# EAGLE board expansion_board_V0 (EAGLE 7.2.0), part 1 of 3
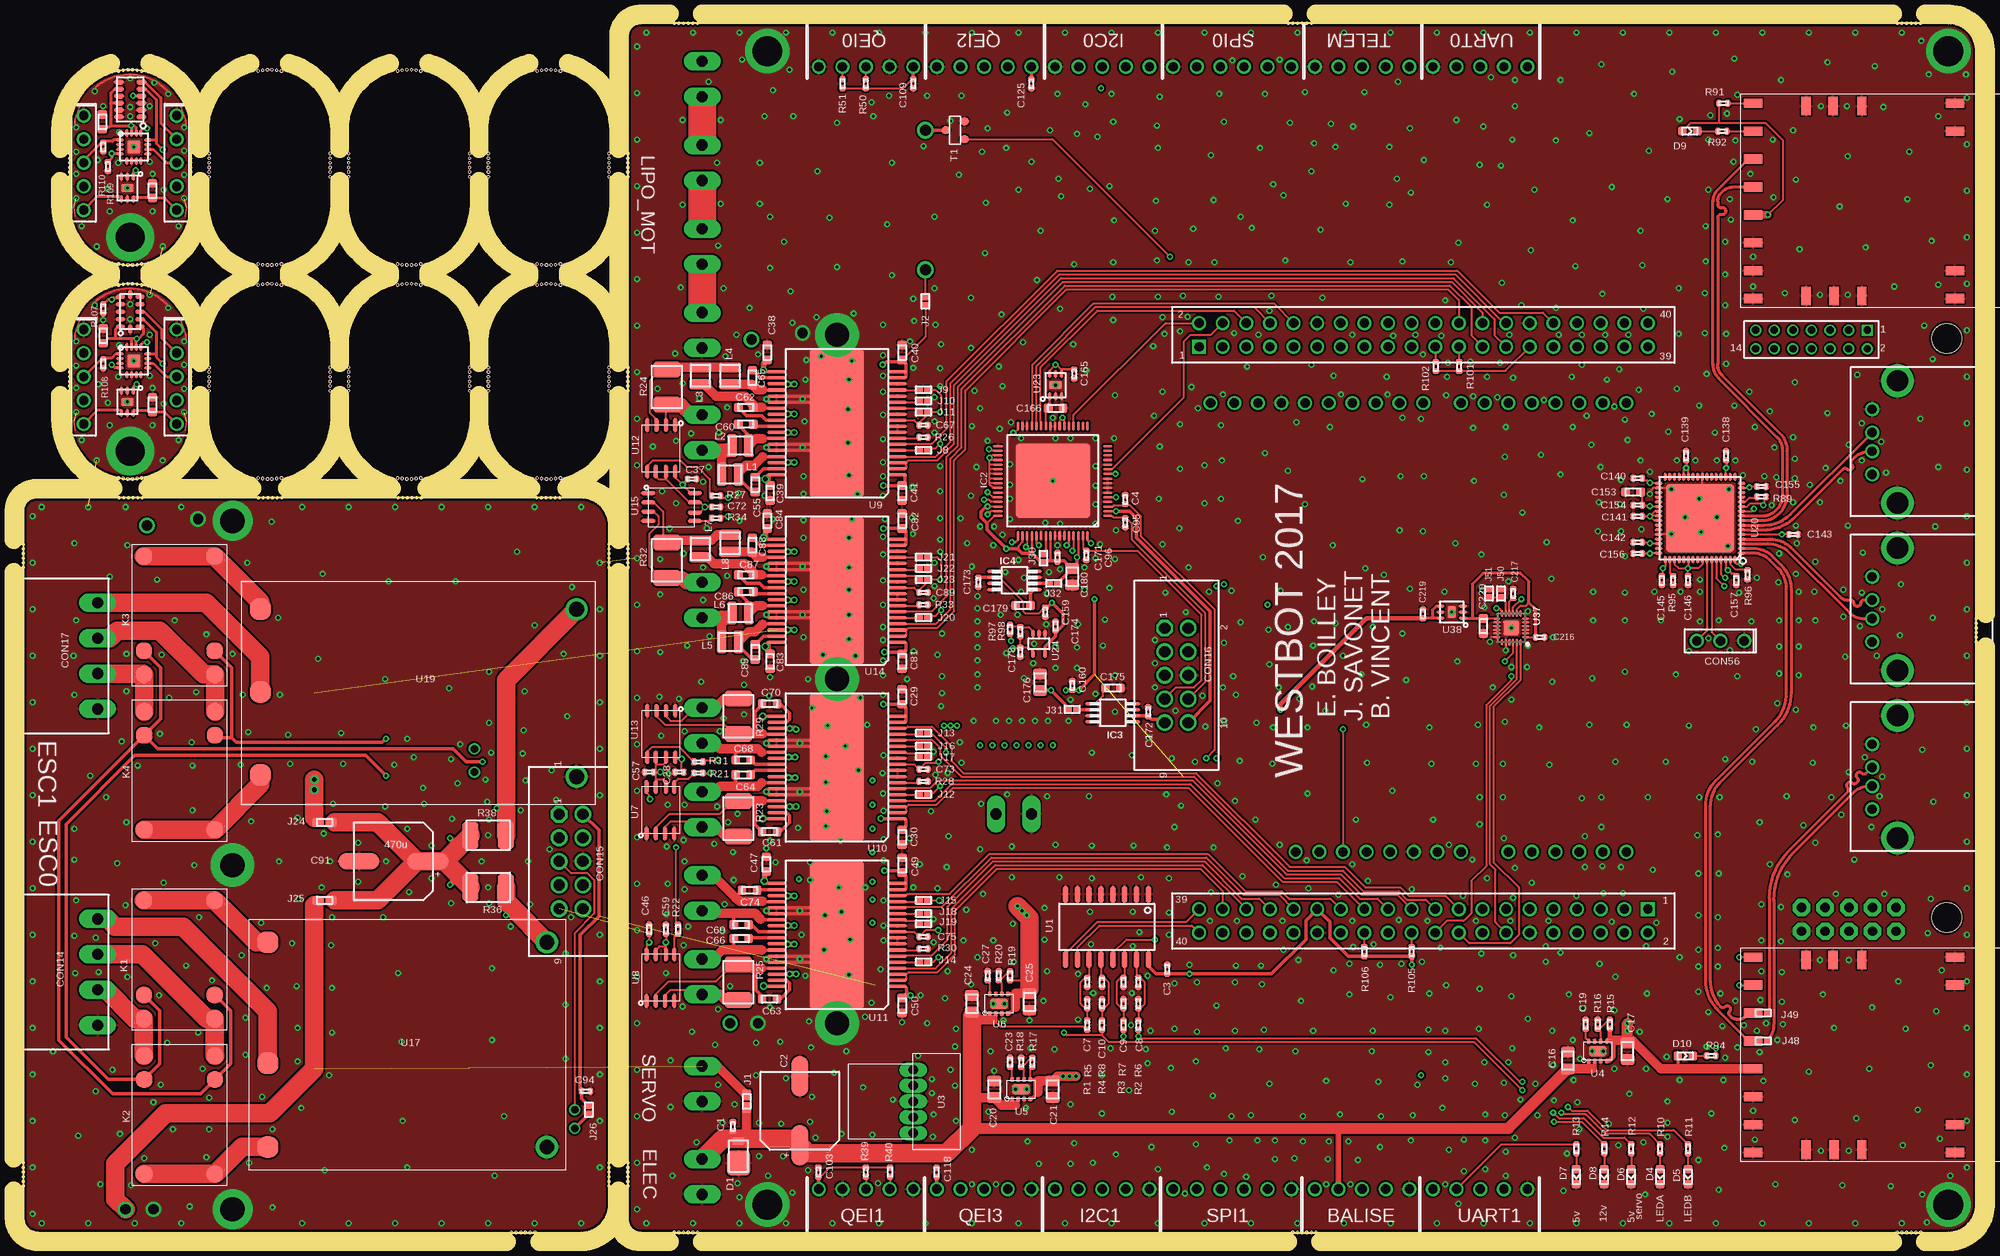
[diagram p8: board, top side]
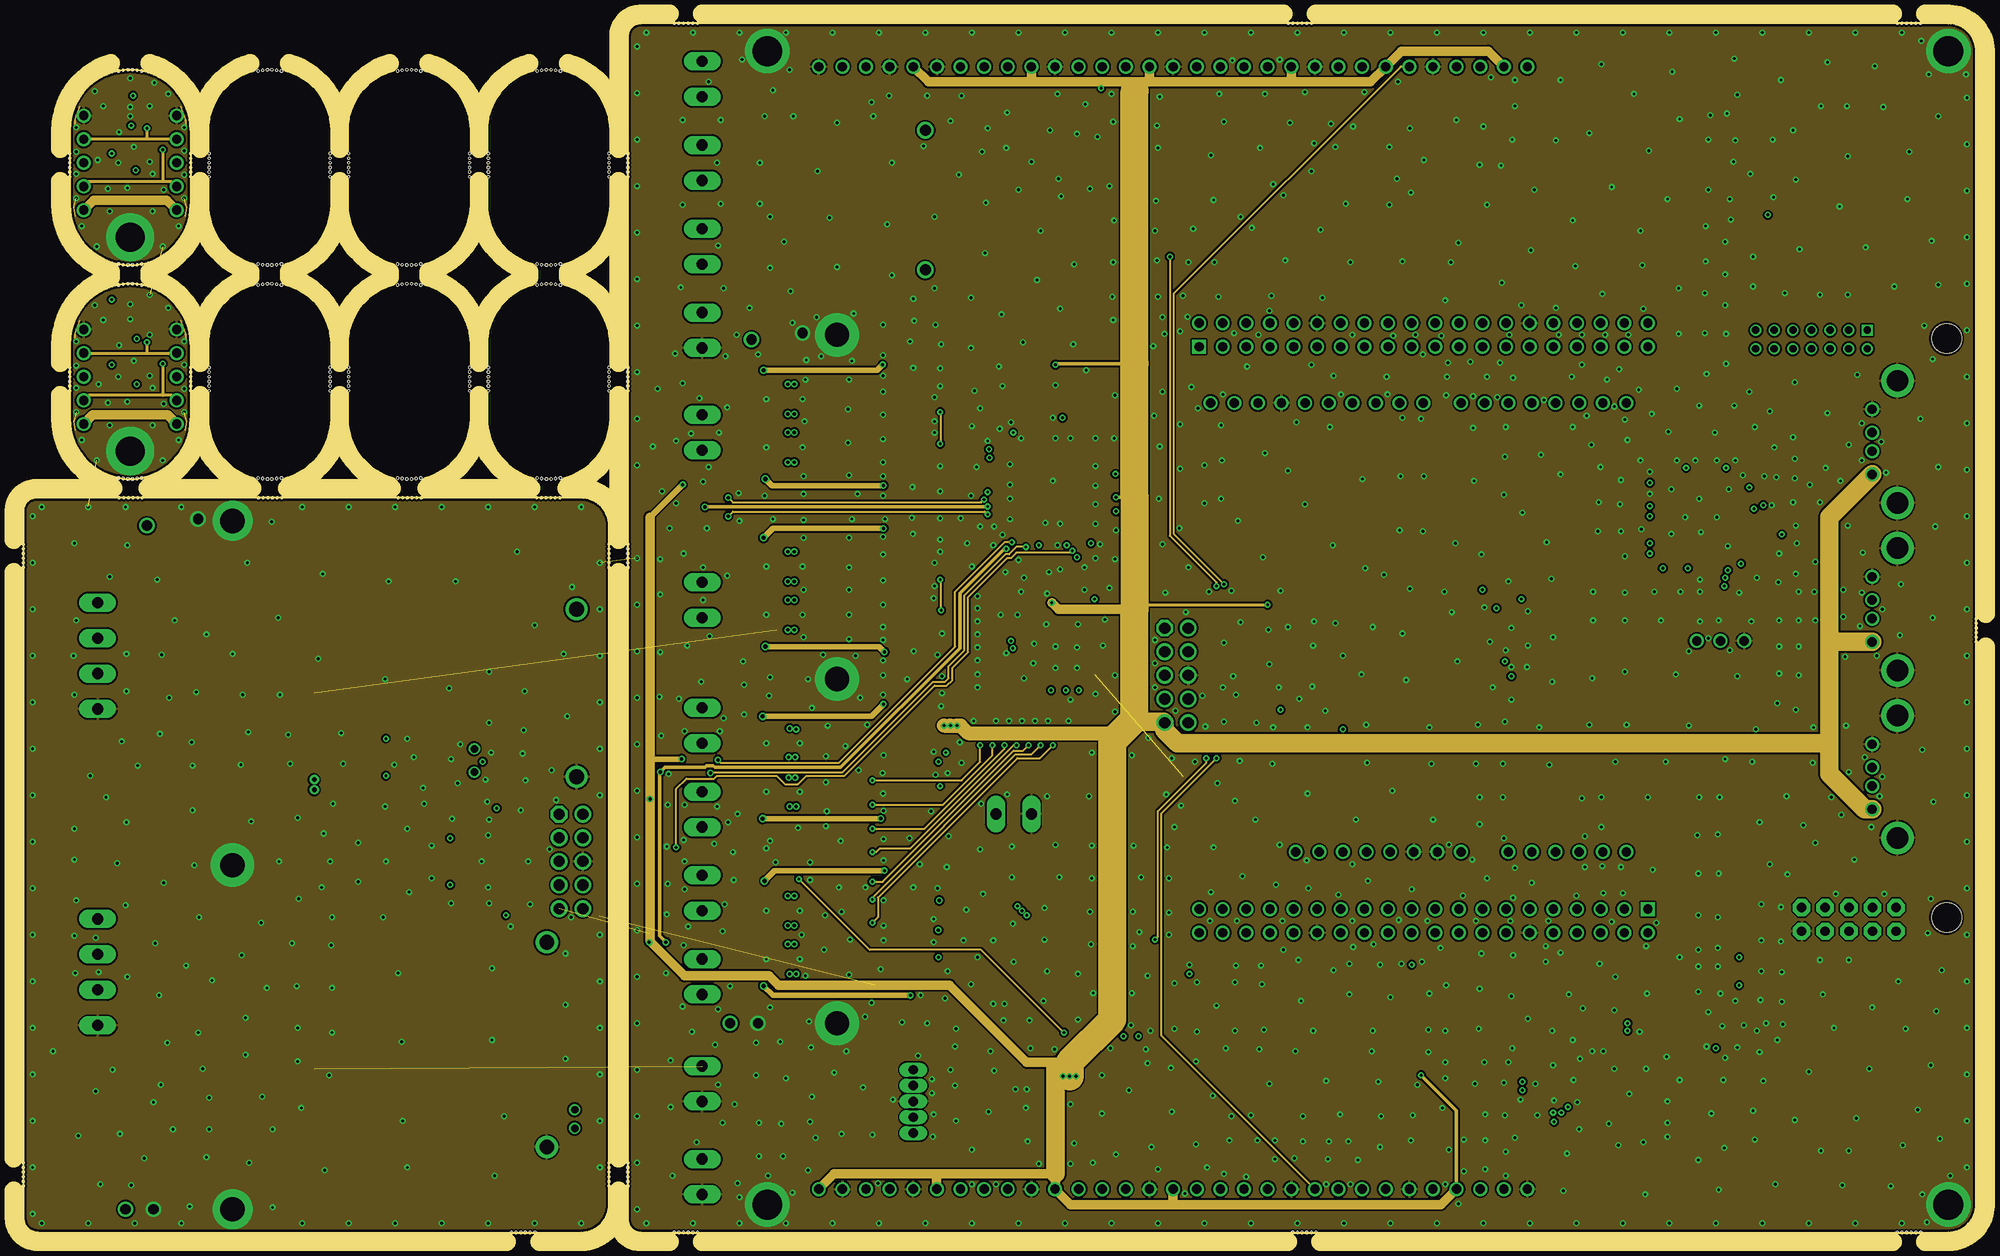
[diagram p9: board, inner layer Route2]
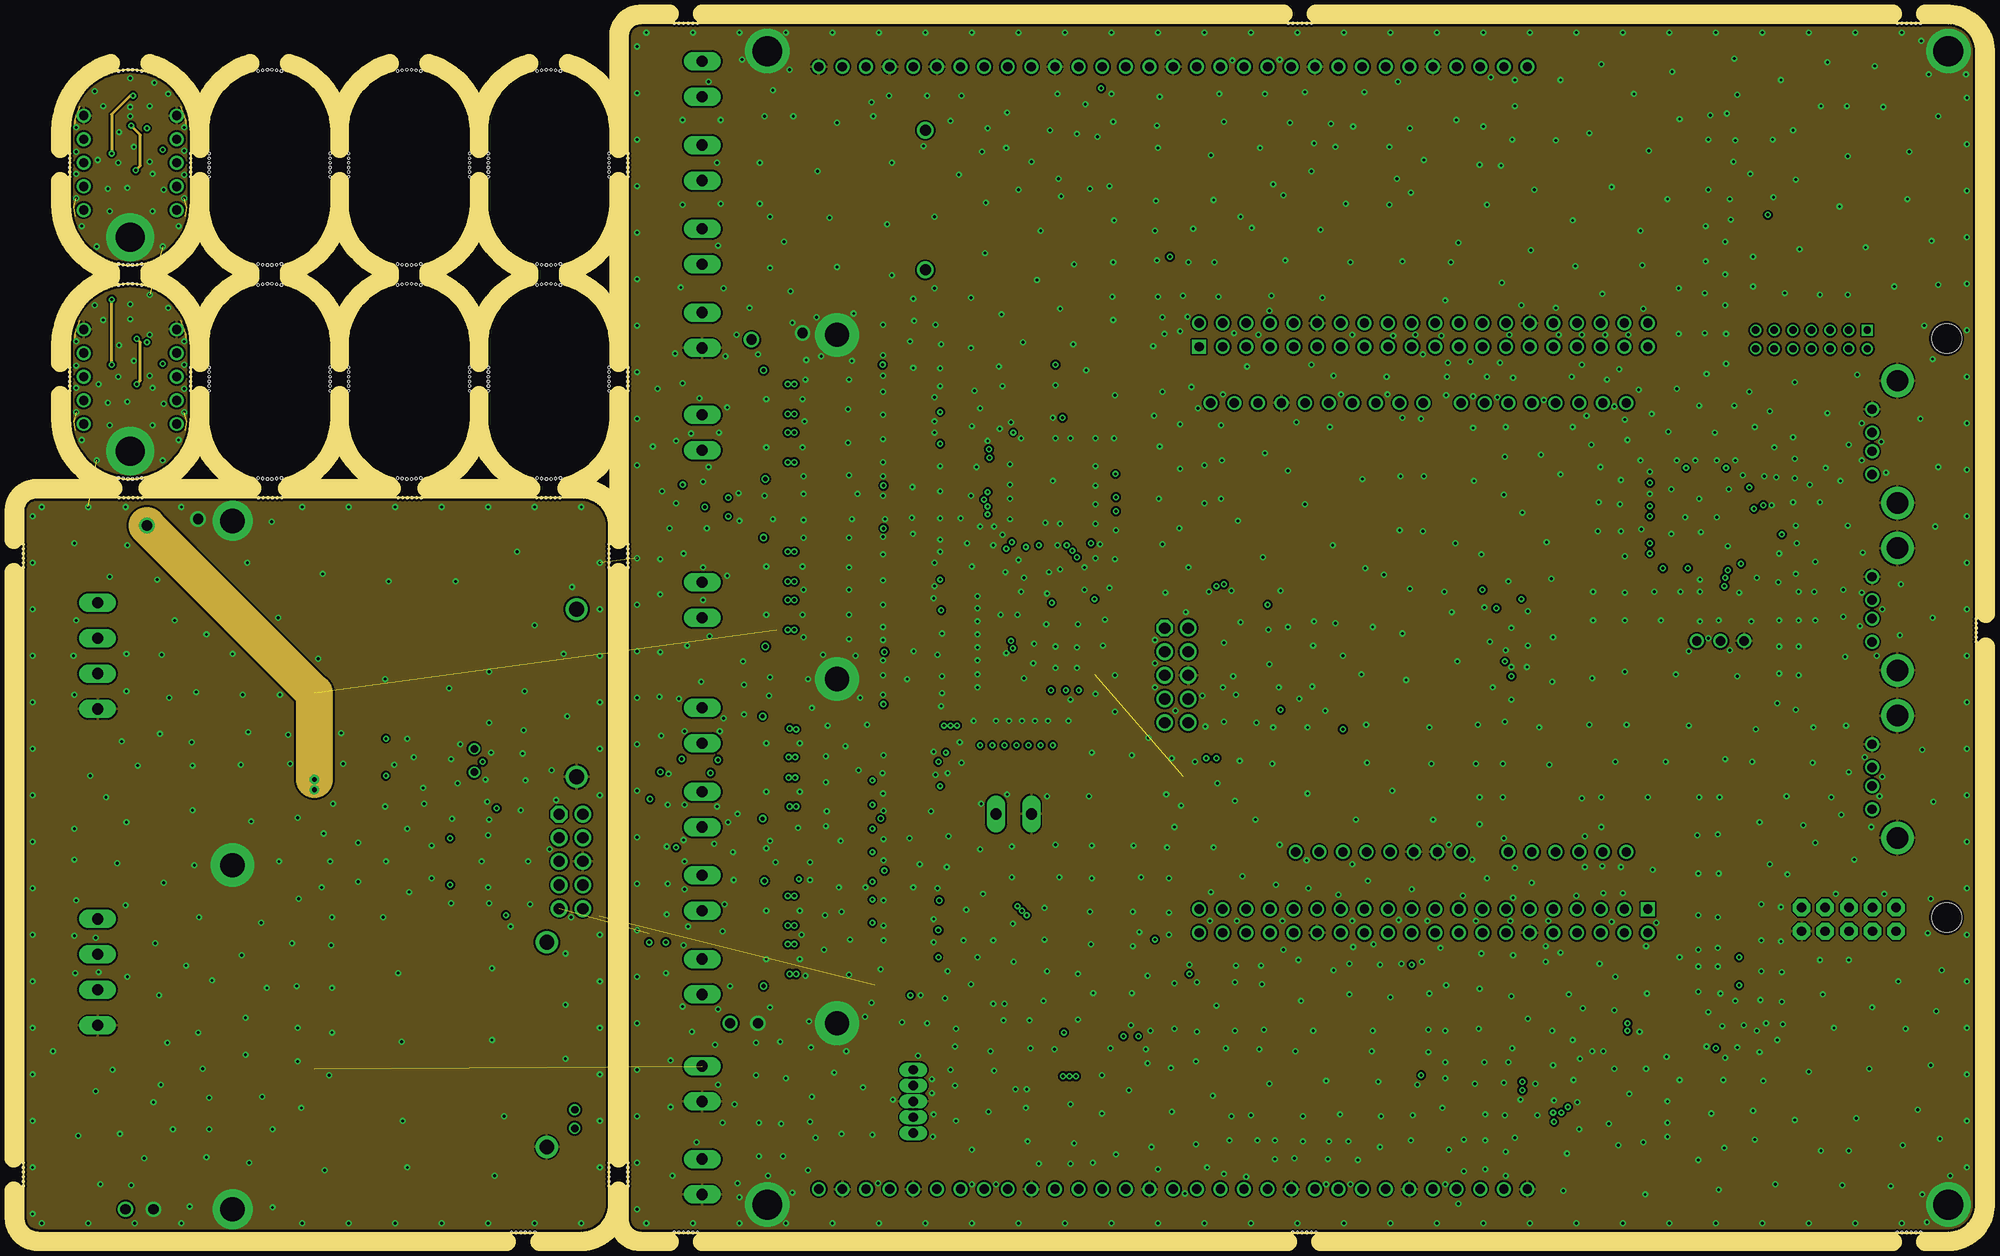
[diagram p10: board, inner layer Route15]
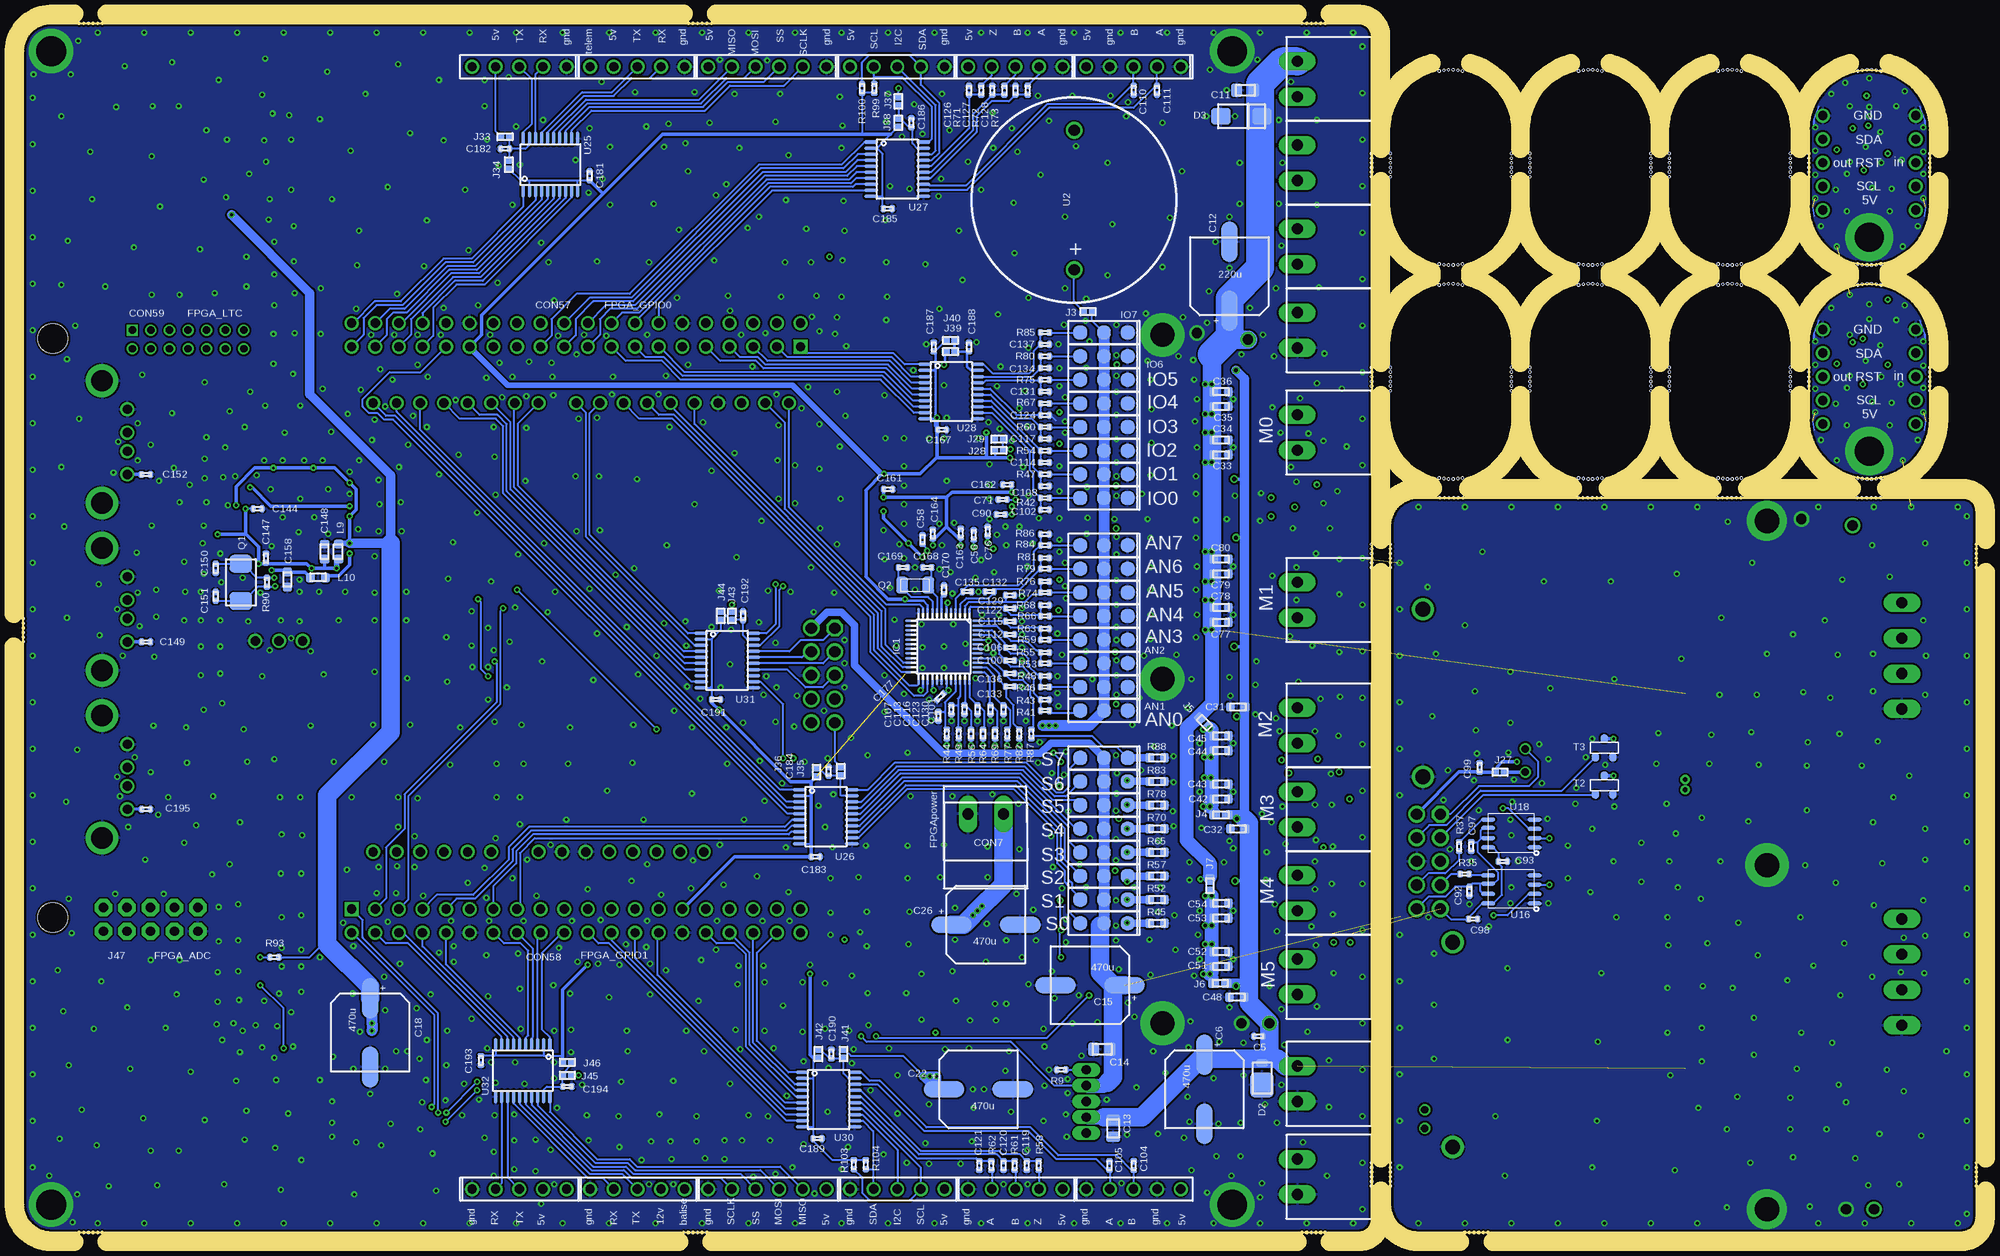
[diagram p11: board, bottom side, seen from below]

Size 210 x 130 mm. Coordinates in mm from the lower left corner, seen from the top.
Outline: 207,130 66.4,130 arc90 65,128.6 65,1.4 arc90 66.4,0 207,0 arc90 210,3 210,127 arc90 207,130
Outline: 60,79 1.4,79 arc90 0,77.6 0,1.6 arc90 1.6,0 60,0 arc90 63,3 63,76 arc90 60,79
Outline: 5,87.5 arc180 18,87.5 18,95.5 arc180 5,95.5 5,87.5
Outline: 5,110.5 arc180 18,110.5 18,118.5 arc180 5,118.5 5,110.5
Copper layers (1*2*15*16): Top 0.035mm / dielectric 10mil / Route2 0.018mm / dielectric 0.46mm / Route15 0.018mm / dielectric 10mil / Bottom 0.035mm
Design rules "Layers4 Classe6 *": minimum track width 0.15mm, minimum drill 0.25mm, track to track 0.15mm, track to pad 0.15mm, pad to pad 0.15mm, via to via 0.15mm, smd to smd 0.15mm, copper to edge 0.25mm, drill to drill 0.35mm, minimum pad ring 0.175mm, minimum via ring 0.175mm, stop-mask expansion 0mil, vias tented up to drill 0.45mm, thermal gap 0.18mm
Holes 0.25 mm at 5,114 5,114.5 5,115 5,115.5 5,116 5,113.5 18,114 18,114.5 18,115 18,115.5 18,116 18,113.5 12.25,124.95 11.75,125 11.25,125 10.75,124.95 10.25,124.88 12.75,124.88 12.25,104.05 11.75,104 11.25,104 10.75,104.05 10.25,104.12 12.75,104.12 20,114 20,114.5 20,115 20,115.5 20,116 20,113.5 33,114 33,114.5 33,115 33,115.5 33,116 33,113.5 27.25,124.95 26.75,125 26.25,125 25.75,124.95 25.25,124.88 27.75,124.88 27.25,104.05 26.75,104 26.25,104 25.75,104.05 25.25,104.12 27.75,104.12 5,91 5,91.5 5,92 5,92.5 5,93 5,90.5 18,91 18,91.5 18,92 18,92.5 18,93 18,90.5 12.25,101.95 11.75,102 11.25,102 10.75,101.95 10.25,101.88 12.75,101.88 12.25,81.05 11.75,81 11.25,81 10.75,81.05 10.25,81.12 12.75,81.12 35,114 35,114.5 35,115 35,115.5 35,116 35,113.5 48,114 48,114.5 48,115 48,115.5 48,116 48,113.5 42.25,124.95 41.75,125 41.25,125 40.75,124.95 40.25,124.88 42.75,124.88 42.25,104.05 41.75,104 41.25,104 40.75,104.05 40.25,104.12 42.75,104.12 50,114 50,114.5 50,115 50,115.5 50,116 50,113.5 63,114 63,114.5 63,115 63,115.5 63,116 63,113.5 57.25,124.95 56.75,125 56.25,125 55.75,124.95 55.25,124.88 57.75,124.88 57.25,104.05 56.75,104 56.25,104 55.75,104.05 55.25,104.12 57.75,104.12 20,91 20,91.5 20,92 20,92.5 20,93 20,90.5 33,91 33,91.5 33,92 33,92.5 33,93 33,90.5 27.25,101.95 26.75,102 26.25,102 25.75,101.95 25.25,101.88 27.75,101.88 27.25,81.05 26.75,81 26.25,81 25.75,81.05 25.25,81.12 27.75,81.12 35,91 35,91.5 35,92 35,92.5 35,93 35,90.5 48,91 48,91.5 48,92 48,92.5 48,93 48,90.5 42.25,101.95 41.75,102 41.25,102 40.75,101.95 40.25,101.88 42.75,101.88 42.25,81.05 41.75,81 41.25,81 40.75,81.05 40.25,81.12 42.75,81.12 50,91 50,91.5 50,92 50,92.5 50,93 50,90.5 63,91 63,91.5 63,92 63,92.5 63,93 63,90.5 57.25,101.95 56.75,102 56.25,102 55.75,101.95 55.25,101.88 57.75,101.88 57.25,81.05 56.75,81 56.25,81 55.75,81.05 55.25,81.12 57.75,81.12 12.3,79 11.8,79 11.3,79 10.8,79 10.3,79 12.8,79 27.3,79 26.8,79 26.3,79 25.8,79 25.3,79 27.8,79 42.3,79 41.8,79 41.3,79 40.8,79 40.3,79 42.8,79 57.2,79 56.7,79 56.2,79 55.7,79 55.2,79 57.7,79 65,91 65,91.5 65,92 65,92.5 65,93 65,90.5 65,114 65,114.5 65,115 65,115.5 65,116 65,113.5 0,72 0,72.5 0,73 0,73.5 0,74 0,71.5 0,5.5 0,6 0,6.5 0,7 0,7.5 0,5 54.5,0 54,0 53.5,0 53,0 52.5,0 55,0 63,5.5 63,6 63,6.5 63,7 63,7.5 63,5 65,5.5 65,6 65,6.5 65,7 65,7.5 65,5 63,72 63,72.5 63,73 63,73.5 63,74 63,71.5 65,72 65,72.5 65,73 65,73.5 65,74 65,71.5 72,0 71.5,0 71,0 70.5,0 70,0 72.5,0 138.5,0 138,0 137.5,0 137,0 136.5,0 139,0 203.5,0 203,0 202.5,0 202,0 201.5,0 204,0 210,64 210,64.5 210,65 210,65.5 210,66 210,63.5 203.5,130 203,130 202.5,130 202,130 201.5,130 204,130 72,130 71.5,130 71,130 70.5,130 70,130 72.5,130 138,130 137.5,130 137,130 136.5,130 136,130 138.5,130
Holes 3.2 mm at 206.82,96.12 206.82,33.88
Milling: area 15,99 to 23,107; area 30,99 to 38,107; area 45,99 to 53,107; area 60,99 to 64,107; area 60,77 to 64,85; area 45,80 to 53,84; area 30,80 to 38,84; area 15,80 to 23,84; 111 lines

## Footprints (pad centres in the part's own frame; a part is rotated, then mirrored left to right if it is on the bottom)
CAPC1005X55N = smd 0.62 x 0.72: 1 -0.48,0; 2 0.48,0
CAPAE835X1020N = smd 4.4 x 1.8: + -3.7,0; - 3.7,0
CAPC2013X100N = smd 1.15 x 1.45: P$1 -0.9,0; P$2 0.9,0
CAPC1608X95N = smd 0.95 x 1: P$1 -0.8,0; P$2 0.8,0
PHOENIX381P900X920-2N = drill 1.2 pad 2 long: P$1 -1.905,0; P$2 1.905,0
PHOENIX381P1662X920-4N = drill 1.2 pad 2 long: P$1 -5.715,0; P$2 -1.905,0; P$3 1.905,0; P$4 5.715,0
CON245P2030X890-2X5N = drill 1.2 pad 1.8 octagon: P$1 -5.08,-1.27 | drill 1.2 pad 1.8: P$2 -5.08,1.27; P$3 -2.54,-1.27; P$4 -2.54,1.27; P$5 0,-1.27; P$6 0,1.27; P$7 2.54,-1.27; P$8 2.54,1.27; P$9 5.08,-1.27; P$10 5.08,1.27
CON254P1270X400-5S = drill 1 pad 1.4: 1 -5.08,0; 2 -2.54,0; 3 0,0; 4 2.54,0; 5 5.08,0
CON254P762X400-3SMT = smd 1.5 x 1.5: 1 -2.54,0; 2 0,0; 3 2.54,0
CON254P1524X400-6N-S = drill 1 pad 1.4: 1 -6.35,0; 2 -3.81,0; 3 -1.27,0; 4 1.27,0; 5 3.81,0; 6 6.35,0
USB_A = drill 1 pad 1.4: 1 0,-3.5; 2 0,-1; 3 0,1; 4 0,3.5 | drill 2.3 pad 3.5: GND1 2.72,-6.57; GND2 2.72,6.57
CON254P762X400-3N-S = drill 1 pad 1.4: 1 -2.54,0; 2 0,0; 3 2.54,0
CON254P5080X600-40N = drill 1 pad 1.45 square: 1 -24.13,-1.27 | drill 1 pad 1.45: 2 -24.13,1.27; 3 -21.59,-1.27; 4 -21.59,1.27; 5 -19.05,-1.27; 6 -19.05,1.27; 7 -16.51,-1.27; 8 -16.51,1.27; 9 -13.97,-1.27; 10 -13.97,1.27; 11 -11.43,-1.27; 12 -11.43,1.27; 13 -8.89,-1.27; 14 -8.89,1.27; 15 -6.35,-1.27; 16 -6.35,1.27; 17 -3.81,-1.27; 18 -3.81,1.27; 19 -1.27,-1.27; 20 -1.27,1.27; 21 1.27,-1.27; 22 1.27,1.27; 23 3.81,-1.27; 24 3.81,1.27; 25 6.35,-1.27; 26 6.35,1.27; 27 8.89,-1.27; 28 8.89,1.27; 29 11.43,-1.27; 30 11.43,1.27; 31 13.97,-1.27; 32 13.97,1.27; 33 16.51,-1.27; 34 16.51,1.27; 35 19.05,-1.27; 36 19.05,1.27; 37 21.59,-1.27; 38 21.59,1.27; 39 24.13,-1.27; 40 24.13,1.27
CON200P1700X400-2X7N = drill 0.8 pad 1.2 square: P$1 -6,-1 | drill 0.8 pad 1.2: P$2 -6,1; P$3 -4,-1; P$4 -4,1; P$5 -2,-1; P$6 -2,1; P$7 0,-1; P$8 0,1; P$9 2,-1; P$10 2,1; P$11 4,-1; P$12 4,1; P$13 6,-1; P$14 6,1
DO220AA = smd 2.667 x 2.54: A -1.333,0 | smd 0.762 x 1.27: C 1.016,0
D0214AC = smd 2.1 x 1.8: A -2.2,0; C 2.2,0
LEDC1608X60N = smd 0.9 x 0.95: A -0.8,0; C 0.8,0
QFN48 = smd 1.1 x 0.25: 1 -3.6,2.75; 2 -3.6,2.25; 3 -3.6,1.75; 4 -3.6,1.25; 5 -3.6,0.75; 6 -3.6,0.25; 7 -3.6,-0.25; 8 -3.6,-0.75; 9 -3.6,-1.25; 10 -3.6,-1.75; 11 -3.6,-2.25; 12 -3.6,-2.75; 25 3.6,-2.75; 26 3.6,-2.25; 27 3.6,-1.75; 28 3.6,-1.25; 29 3.6,-0.75; 30 3.6,-0.25; 31 3.6,0.25; 32 3.6,0.75; 33 3.6,1.25; 34 3.6,1.75; 35 3.6,2.25; 36 3.6,2.75 | smd 0.25 x 1.1: 13 -2.75,-3.6; 14 -2.25,-3.6; 15 -1.75,-3.6; 16 -1.25,-3.6; 17 -0.75,-3.6; 18 -0.25,-3.6; 19 0.25,-3.6; 20 0.75,-3.6; 21 1.25,-3.6; 22 1.75,-3.6; 23 2.25,-3.6; 24 2.75,-3.6; 37 2.75,3.6; 38 2.25,3.6; 39 1.75,3.6; 40 1.25,3.6; 41 0.75,3.6; 42 0.25,3.6; 43 -0.25,3.6; 44 -0.75,3.6; 45 -1.25,3.6; 46 -1.75,3.6; 47 -2.25,3.6; 48 -2.75,3.6
TQFP64_POWERPAD = smd 1 x 0.27: 1 -5.9,3.75; 2 -5.9,3.25; 3 -5.9,2.75; 4 -5.9,2.25; 5 -5.9,1.75; 6 -5.9,1.25; 7 -5.9,0.75; 8 -5.9,0.25; 9 -5.9,-0.25; 10 -5.9,-0.75; 11 -5.9,-1.25; 12 -5.9,-1.75; 13 -5.9,-2.25; 14 -5.9,-2.75; 15 -5.9,-3.25; 16 -5.9,-3.75; 33 5.9,-3.75; 34 5.9,-3.25; 35 5.9,-2.75; 36 5.9,-2.25; 37 5.9,-1.75; 38 5.9,-1.25; 39 5.9,-0.75; 40 5.9,-0.25; 41 5.9,0.25; 42 5.9,0.75; 43 5.9,1.25; 44 5.9,1.75; 45 5.9,2.25; 46 5.9,2.75; 47 5.9,3.25; 48 5.9,3.75 | smd 0.27 x 1: 17 -3.75,-5.9; 18 -3.25,-5.9; 19 -2.75,-5.9; 20 -2.25,-5.9; 21 -1.75,-5.9; 22 -1.25,-5.9; 23 -0.75,-5.9; 24 -0.25,-5.9; 25 0.25,-5.9; 26 0.75,-5.9; 27 1.25,-5.9; 28 1.75,-5.9; 29 2.25,-5.9; 30 2.75,-5.9; 31 3.25,-5.9; 32 3.75,-5.9; 49 3.75,5.9; 50 3.25,5.9; 51 2.75,5.9; 52 2.25,5.9; 53 1.75,5.9; 54 1.25,5.9; 55 0.75,5.9; 56 0.25,5.9; 57 -0.25,5.9; 58 -0.75,5.9; 59 -1.25,5.9; 60 -1.75,5.9; 61 -2.25,5.9; 62 -2.75,5.9; 63 -3.25,5.9; 64 -3.75,5.9 | smd 8 x 8: POWERPAD 0,0
MSOP8_0.65 = smd 1.2 x 0.4: 1 -2.35,0.975; 2 -2.35,0.325; 3 -2.35,-0.325; 4 -2.35,-0.975; 5 2.35,-0.975; 6 2.35,-0.325; 7 2.35,0.325; 8 2.35,0.975
JUMC1608X50AN = smd 1.2 x 1: P$1 -0.675,0; P$2 0.675,0
JUMC1005X50N = smd 0.68 x 0.72: P$1 -0.42,0; P$2 0.42,0
2X5_NOSILK = drill 1.016 pad 1.88 octagon: 1 -1.27,5.08; 2 1.27,5.08; 3 -1.27,2.54; 4 1.27,2.54; 5 -1.27,0; 6 1.27,0; 7 -1.27,-2.54; 8 1.27,-2.54; 9 -1.27,-5.08; 10 1.27,-5.08
V23101-D0103-A201-SMT = smd 1.778 x 1.778: 1 0,0; 2 2.54,0; 6 12.7,0; 7 12.7,7.62; 11 2.54,7.62; 12 0,7.62
INDC2520X120N = smd 1.05 x 2.4: P$1 -0.9,0; P$2 0.9,0
INDC1608X95N = smd 0.95 x 1: 1 -0.8,0; 2 0.8,0
XTAL500X320X130N = smd 1.9 x 2.4: 1 -2,0; 2 2,0
1206 = smd 1.3 x 1.8: P$1 -1.4,0; P$2 1.4,0
RESC1005X40N = smd 0.62 x 0.72: 1 -0.48,0; 2 0.48,0
RESC_ULR15S-R0055FT2 = smd 1.7 x 2.9: P$1 -1.9,0; P$2 1.9,0
RESC1608X50AN = smd 0.95 x 1: P$1 -0.8,0; P$2 0.8,0
SOT95P290X130-3N = smd 0.8 x 0.9: P$1 -0.95,-1; P$2 0.95,-1; P$3 0,1
SOIC127P780X200-16N = smd 1.85 x 0.6: 1 -3.5,4.445; 2 -3.5,3.175; 3 -3.5,1.905; 4 -3.5,0.635; 5 -3.5,-0.635; 6 -3.5,-1.905; 7 -3.5,-3.175; 8 -3.5,-4.445; 9 3.5,-4.445; 10 3.5,-3.175; 11 3.5,-1.905; 12 3.5,-0.635; 13 3.5,0.635; 14 3.5,1.905; 15 3.5,3.175; 16 3.5,4.445
BUZZER_CIRCLE = drill 1.2 pad 1.6: + -7.5,0; - 7.5,0
PTR08100W = drill 1 pad 1.27 long: P$1 3.4,0; P$2 1.7,0; P$3 0,0; P$4 -1.7,0; P$5 -3.4,0
SON65P310X290X153-9N = smd 0.5 x 0.4: P$1 -1.05,0.975; P$2 -1.05,0.325; P$3 -1.05,-0.325; P$4 -1.05,-0.975; P$5 1.05,-0.975; P$6 1.05,-0.325; P$7 1.05,0.325; P$8 1.05,0.975 | smd 1.1 x 1.9: P$9 0,0
TSSOP = smd 1.5 x 0.45: P$1 -2.5,1.6; P$2 -2.5,0.6; P$3 -2.5,-0.4; P$4 -2.5,-1.4; P$5 2.5,1.6; P$6 2.5,0.6; P$7 2.5,-0.5; P$8 2.5,-1.4
R-PDSO-G36 = smd 0.4 x 2: P$1 -5.525,-6.5; P$2 -4.875,-6.5; P$3 -4.225,-6.5; P$4 -3.575,-6.5; P$5 -2.925,-6.5; P$6 -2.275,-6.5; P$7 -1.625,-6.5; P$8 -0.975,-6.5; P$9 -0.325,-6.5; P$10 0.325,-6.5; P$11 0.975,-6.5; P$12 1.625,-6.5; P$13 2.275,-6.5; P$14 2.925,-6.5; P$15 3.575,-6.5; P$16 4.225,-6.5; P$17 4.875,-6.5; P$18 5.525,-6.5; P$19 5.525,6.5; P$20 4.875,6.5; P$21 4.225,6.5; P$22 3.575,6.5; P$23 2.925,6.5; P$24 2.275,6.5; P$25 1.625,6.5; P$26 0.975,6.5; P$27 0.325,6.5; P$28 -0.325,6.5; P$29 -0.975,6.5; P$30 -1.625,6.5; P$31 -2.275,6.5; P$32 -2.925,6.5; P$33 -3.575,6.5; P$34 -4.225,6.5; P$35 -4.875,6.5; P$36 -5.525,6.5 | smd 15.8 x 5.8: P$37 0,0
ESC_TURNIGY40A = drill 1.6 pad 2.2: GND -30,22; PWR -30,0 | drill 0.8 pad 1.2: PWM -33,18; VCC -33,20 | smd 2.286 x 2.286: U 0,0; V 0,13; W 0,22
ESC_CHINOI15A = drill 1.6 pad 2.2: GND -34,18; PWR -34,0 | drill 0.8 pad 1.2: PWM -23,15; VCC -23,17.5 | smd 2.286 x 2.286: U 0,0; V 0,8.89; W 0,17.78
QFN50P900X900X100-65N = smd 0.85 x 0.3: 1 -4.45,3.75; 2 -4.45,3.25; 3 -4.45,2.75; 4 -4.45,2.25; 5 -4.45,1.75; 6 -4.45,1.25; 7 -4.45,0.75; 8 -4.45,0.25; 9 -4.45,-0.25; 10 -4.45,-0.75; 11 -4.45,-1.25; 12 -4.45,-1.75; 13 -4.45,-2.25; 14 -4.45,-2.75; 15 -4.45,-3.25; 16 -4.45,-3.75; 33 4.45,-3.75; 34 4.45,-3.25; 35 4.45,-2.75; 36 4.45,-2.25; 37 4.45,-1.75; 38 4.45,-1.25; 39 4.45,-0.75; 40 4.45,-0.25; 41 4.45,0.25; 42 4.45,0.75; 43 4.45,1.25; 44 4.45,1.75; 45 4.45,2.25; 46 4.45,2.75; 47 4.45,3.25; 48 4.45,3.75 | smd 0.3 x 0.85: 17 -3.75,-4.45; 18 -3.25,-4.45; 19 -2.75,-4.45; 20 -2.25,-4.45; 21 -1.75,-4.45; 22 -1.25,-4.45; 23 -0.75,-4.45; 24 -0.25,-4.45; 25 0.25,-4.45; 26 0.75,-4.45; 27 1.25,-4.45; 28 1.75,-4.45; 29 2.25,-4.45; 30 2.75,-4.45; 31 3.25,-4.45; 32 3.75,-4.45; 49 3.75,4.45; 50 3.25,4.45; 51 2.75,4.45; 52 2.25,4.45; 53 1.75,4.45; 54 1.25,4.45; 55 0.75,4.45; 56 0.25,4.45; 57 -0.25,4.45; 58 -0.75,4.45; 59 -1.25,4.45; 60 -1.75,4.45; 61 -2.25,4.45; 62 -2.75,4.45; 63 -3.25,4.45; 64 -3.75,4.45 | smd 7.3 x 7.3: GND 0,0
LGA22U = smd 1 x 2: P$1 22,1.3; P$2 1,1.3; P$3 4,1.3; P$4 7,1.3; P$5 10,1.3; P$6 13,1.3; P$7 16,1.3; P$8 19,1.3; P$9 1,23; P$10 4,23; P$11 22,23; P$12 19,23 | smd 2 x 1: P$13 21.7,13; P$14 21.7,10; P$15 21.7,7; P$16 1.3,13; P$17 1.3,9.9; P$18 1.3,7
SON65P250X220X80-7N = smd 0.3 x 0.85: 1 -0.65,-1.2; 2 0,-1.2; 3 0.65,-1.2; 4 0.65,1.2; 5 0,1.2; 6 -0.65,1.2 | smd 1.3 x 0.85: GND 0,0
SC70-5N = smd 0.35 x 0.85: P$1 -0.65,-1.1; P$2 0,-1.1; P$3 0.65,-1.1; P$4 0.65,1.1; P$5 -0.65,1.1
SOP65P640X110-20N = smd 0.4 x 1.5: P$1 -2.925,-2.8; P$2 -2.275,-2.8; P$3 -1.625,-2.8; P$4 -0.975,-2.8; P$5 -0.325,-2.8; P$6 0.325,-2.8; P$7 0.975,-2.8; P$8 1.625,-2.8; P$9 2.275,-2.8; P$10 2.925,-2.8; P$11 2.925,2.8; P$12 2.275,2.8; P$13 1.625,2.8; P$14 0.975,2.8; P$15 0.325,2.8; P$16 -0.325,2.8; P$17 -0.975,2.8; P$18 -1.625,2.8; P$19 -2.275,2.8; P$20 -2.925,2.8
ARDUINOR3 = drill 1 pad 1.5: 3V 35.56,2.54; 5V 38.1,2.54; A0 50.8,2.54; A1 53.34,2.54; A2 55.88,2.54; A3 58.42,2.54; A4 60.96,2.54; A5 63.5,2.54; AREF 23.876,50.8; D0 63.5,50.8; D1 60.96,50.8; D2 58.42,50.8; D3 55.88,50.8; D4 53.34,50.8; D5 50.8,50.8; D6 48.26,50.8; D7 45.72,50.8; D8 41.656,50.8; D9 39.116,50.8; D10 36.576,50.8; D11 34.036,50.8; D12 31.496,50.8; D13 28.956,50.8; GND 26.416,50.8; GND1 43.18,2.54; GND2 40.64,2.54; IOREF 30.48,2.54; RESERVED 27.94,2.54; RESET 33.02,2.54; SCL 18.796,50.8; SDA 21.336,50.8; VIN 45.72,2.54
VL53L0X = smd 1 x 0.5: P$1 -1.05,-1.6; P$2 -1.05,-0.8; P$3 -1.05,0; P$4 -1.05,0.8; P$5 -1.05,1.6; P$7 1.05,1.6; P$8 1.05,0.8; P$9 1.05,0; P$10 1.05,-0.8; P$11 1.05,-1.6 | smd 0.5 x 1: P$6 0,1.85; P$12 0,-1.85
QFN50P300X300X80-17N = smd 1.45 x 1.45: GND 0,0 | smd 0.3 x 0.8: P$1 -0.75,-1.5; P$2 -0.25,-1.5; P$3 0.25,-1.5; P$4 0.75,-1.5; P$9 0.75,1.5; P$10 0.25,1.5; P$11 -0.25,1.5; P$12 -0.75,1.5 | smd 0.8 x 0.3: P$5 1.5,-0.75; P$6 1.5,-0.25; P$7 1.5,0.25; P$8 1.5,0.75; P$13 -1.5,0.75; P$14 -1.5,0.25; P$15 -1.5,-0.25; P$16 -1.5,-0.75
VL6180X = smd 1.1 x 0.55: P$1 -1.2,1.875; P$2 -1.2,1.125; P$3 -1.2,0.375; P$4 -1.2,-0.375; P$5 -1.2,-1.125; P$6 -1.2,-1.875; P$7 1.2,-1.875; P$8 1.2,-1.125; P$9 1.2,-0.375; P$10 1.2,0.375; P$11 1.2,1.125; P$12 1.2,1.875
QFN24-3X3 = smd 0.72 x 0.22: 1 -1.552,1; 6 -1.552,-1; 13 1.552,-1; 18 1.552,1 | smd 0.8 x 0.22: 2 -1.55,0.6; 3 -1.55,0.2; 4 -1.55,-0.2; 5 -1.55,-0.6; 14 1.55,-0.6; 15 1.55,-0.2; 16 1.55,0.2; 17 1.55,0.6 | smd 0.22 x 0.72: 7 -1,-1.552; 12 1,-1.552; 19 1,1.552; 24 -1,1.552 | smd 0.22 x 0.8: 8 -0.6,-1.55; 9 -0.2,-1.55; 10 0.2,-1.55; 11 0.6,-1.55; 20 0.6,1.55; 21 0.2,1.55; 22 -0.2,1.55; 23 -0.6,1.55 | smd 1.7 x 1.54: PAD 0,0

## Placement (x,y rotation side)
C1  100n  [CAPC1005X55N]  76.3,11.4 90 top
C2  470u  [CAPAE835X1020N]  83.5,13.1 90 top
C3  100n  [CAPC1005X55N]  123,28.3 90 top
C4  100p  [CAPC1005X55N]  118.5,78.8 90 top
C5  100n  [CAPC1005X55N]  77.2,21.1 180 bottom
C6  470u  [CAPAE835X1020N]  83,15.4 270 bottom
C7  100n  [CAPC1005X55N]  114.4,26.9 270 top
C8  100n  [CAPC1005X55N]  119.9,26.9 270 top
C9  100n  [CAPC1005X55N]  118.3,26.9 270 top
C10  100n  [CAPC1005X55N]  116,26.9 270 top
C11  100n  [CAPC2013X100N]  78.6,122.8 180 bottom
C12  220u  [CAPAE835X1020N]  80.3,102.8 90 bottom
C13  10u  [CAPC2013X100N]  92.8,11.2 270 bottom
C14  10u  [CAPC2013X100N]  94,19.7 180 bottom
C15  470u  [CAPAE835X1020N]  95.3,26.6 180 bottom
C16  10u  [CAPC2013X100N]  166.1,18.5 90 top
C17  10u  [CAPC2013X100N]  172.5,19.5 270 top
C18  470u  [CAPAE835X1020N]  172.7,21.5 270 bottom
C19  22n  [CAPC1005X55N]  168,22.4 90 top
C20  10u  [CAPC2013X100N]  104.4,15.4 90 top
C21  10u  [CAPC2013X100N]  110.7,15.4 270 top
C22  470u  [CAPAE835X1020N]  107.3,15.4 0 bottom
C23  1n  [CAPC1005X55N]  106.1,18.3 90 top
C24  10u  [CAPC2013X100N]  102,24.6 90 top
C25  10u  [CAPC2013X100N]  108.2,24.8 270 top
C26  470u  [CAPAE835X1020N]  106.5,33.1 0 bottom
C27  nc  [CAPC1005X55N]  103.7,27.6 90 top
C28  100n  [CAPC1005X55N]  70.55,49.5 0 top
C29  1µ  [CAPC1608X95N]  94.5,57.6 270 top
C30  1µ  [CAPC1608X95N]  94.5,42.5 90 top
C31  1µ  [CAPC1608X95N]  79.4,56.5 0 bottom
C32  1µ  [CAPC1608X95N]  79.4,43.4 0 bottom
C33  100n  [CAPC1608X95N]  81.2,83.6 180 bottom
C34  100n  [CAPC1608X95N]  81.2,85.2 180 bottom
C35  100n  [CAPC1608X95N]  81.2,88.8 180 bottom
C36  100n  [CAPC1608X95N]  81.2,90.4 180 bottom
C37  100n  [CAPC1005X55N]  71.9,81 180 top
C38  1µ  [CAPC1608X95N]  80,94.6 270 top
C39  1µ  [CAPC1608X95N]  80.3,79.5 90 top
C40  1µ  [CAPC1608X95N]  94.5,94.6 270 top
C41  1µ  [CAPC1608X95N]  94.5,79.5 90 top
C42  100n  [CAPC1608X95N]  81.2,46.6 180 bottom
C43  100n  [CAPC1608X95N]  81.2,48.2 180 bottom
C44  100n  [CAPC1608X95N]  81.2,51.8 180 bottom
C45  100n  [CAPC1608X95N]  81.2,53.4 180 bottom
C46  100n  [CAPC1005X55N]  67.3,32.6 270 top
C47  1µ  [CAPC1608X95N]  79.9,39.6 270 top
C48  1µ  [CAPC1608X95N]  79.5,25.3 0 bottom
C49  1µ  [CAPC1608X95N]  94.5,39.5 270 top
C50  1µ  [CAPC1608X95N]  94.5,24.4 90 top
C51  100n  [CAPC1608X95N]  81.2,28.6 180 bottom
C52  100n  [CAPC1608X95N]  81.2,30.2 180 bottom
C53  100n  [CAPC1608X95N]  81.2,33.8 180 bottom
C54  100n  [CAPC1608X95N]  81.2,35.4 180 bottom
C55  100n  [CAPC1608X95N]  78.7,80.4 270 top
C56  1n  [CAPC1005X55N]  107.8,75 270 bottom
C57  10n  [CAPC1005X55N]  67.3,49.5 0 top
C58  1n  [CAPC1005X55N]  113.3,74.5 270 bottom
C59  10n  [CAPC1005X55N]  69.1,32.6 270 top
C60  100n  [CAPC1608X95N]  77.7,86.9 180 top
C61  100n  [CAPC1608X95N]  80.25,43.1 180 top
C62  100n  [CAPC1608X95N]  77.7,88.7 0 top
C63  100n  [CAPC1608X95N]  80.25,25.1 180 top
C64  100n  [CAPC1608X95N]  77.4,49.2 180 top
C65  100n  [CAPC1608X95N]  78.4,91.9 270 top
C66  100n  [CAPC1608X95N]  77.2,31.6 180 top
C67  100n  [CAPC1005X55N]  96.8,86.8 180 top
C68  100n  [CAPC1608X95N]  77.4,50.8 180 top
C69  100n  [CAPC1608X95N]  77.2,33.1 180 top
C70  100n  [CAPC1608X95N]  80.25,56.85 180 top
C71  1n  [CAPC1005X55N]  104.7,78.8 0 bottom
C72  10n  [CAPC1005X55N]  74.5,78 180 top
C73  100n  [CAPC1005X55N]  96.8,49.8 180 top
C74  100n  [CAPC1608X95N]  78.1,36.8 180 top
C75  100n  [CAPC1005X55N]  96.8,31.8 180 top
C76  1n  [CAPC1005X55N]  106.3,75.4 270 bottom
C77  100n  [CAPC1608X95N]  81.2,65.6 180 bottom
C78  100n  [CAPC1608X95N]  81.2,67.2 180 bottom
C79  100n  [CAPC1608X95N]  81.2,70.8 180 bottom
C80  100n  [CAPC1608X95N]  81.2,72.4 180 bottom
C81  1µ  [CAPC1608X95N]  94.5,61.4 90 top
C82  1µ  [CAPC1608X95N]  94.5,76.5 270 top
C83  1µ  [CAPC1608X95N]  80.3,61.4 90 top
C84  1µ  [CAPC1608X95N]  80,76.5 270 top
C85  100n  [CAPC1608X95N]  78.7,62.4 270 top
C86  100n  [CAPC1608X95N]  77.7,68.9 180 top
C87  100n  [CAPC1608X95N]  77.7,70.7 0 top
C88  100n  [CAPC1608X95N]  78.4,73.9 270 top
C89  100n  [CAPC1005X55N]  96.8,68.8 180 top
C90  1n  [CAPC1005X55N]  104.9,77.2 0 bottom
C91  470u  [CAPAE835X1020N]  39.8,39.9 180 top
C92  10n  [CAPC1005X55N]  54.5,36.7 90 bottom
C93  100n  [CAPC1005X55N]  50.9,39.9 0 bottom
C94  100n  [CAPC1005X55N]  60.5,15.2 0 top
C95  1n  [CAPC1005X55N]  118.5,76.3 90 top
C96  1n  [CAPC1005X55N]  114.3,72.8 90 top
C97  10n  [CAPC1005X55N]  54.3,41.5 90 bottom
C98  100n  [CAPC1005X55N]  54.1,33.7 0 bottom
C99  100n  [CAPC1005X55N]  53.4,50 90 bottom
C100  100n  [CAPC1005X55N]  103.9,61.5 180 bottom
C101  100n  [CAPC1005X55N]  111.6,55.5 90 bottom
C102  100n  [CAPC1005X55N]  100.14,77.7 180 bottom
C103  100n  [CAPC1005X55N]  85.5,6.5 270 top
C104  1n  [CAPC1005X55N]  90.6,7.2 270 bottom
C105  1n  [CAPC1005X55N]  93.2,7.2 270 bottom
C106  100n  [CAPC1005X55N]  103.9,62.9 180 bottom
C107  100n  [CAPC1005X55N]  110.2,56.2 90 bottom
C108  100n  [CAPC1005X55N]  100.14,80.24 180 bottom
C109  100n  [CAPC1005X55N]  95.7,123.5 90 top
C110  1n  [CAPC1005X55N]  90.6,122.8 90 bottom
C111  1n  [CAPC1005X55N]  88.1,122.8 90 bottom
C112  100n  [CAPC1005X55N]  103.9,64.3 180 bottom
C113  100n  [CAPC1005X55N]  108.8,56.2 90 bottom
C114  100n  [CAPC1005X55N]  100.14,82.78 180 bottom
C115  100n  [CAPC1005X55N]  103.9,65.7 180 bottom
C116  100n  [CAPC1005X55N]  107.4,56.2 90 bottom
C117  nc  [CAPC1005X55N]  100.14,85.32 180 bottom
C118  100n  [CAPC1005X55N]  98.2,6.5 270 top
C119  1n  [CAPC1005X55N]  102.1,7.2 90 bottom
C120  1n  [CAPC1005X55N]  104.6,7.2 90 bottom
C121  1n  [CAPC1005X55N]  107.2,7.2 90 bottom
C122  100n  [CAPC1005X55N]  103.9,67.1 180 bottom
C123  100n  [CAPC1005X55N]  106,56.2 90 bottom
C124  100n  [CAPC1005X55N]  100.14,87.86 180 bottom
C125  100n  [CAPC1005X55N]  108.4,123.5 90 top
C126  1n  [CAPC1005X55N]  108.3,122.8 270 bottom
C127  1n  [CAPC1005X55N]  105.8,122.8 270 bottom
C128  1n  [CAPC1005X55N]  103.3,122.8 270 bottom
C129  100n  [CAPC1005X55N]  103.9,68.5 180 bottom
C130  100n  [CAPC1005X55N]  104.6,56.2 90 bottom
C131  100n  [CAPC1005X55N]  100.14,90.4 180 bottom
C132  100n  [CAPC1005X55N]  106.1,68.9 0 bottom
C133  100n  [CAPC1005X55N]  103.9,58.7 180 bottom
C134  nc  [CAPC1005X55N]  100.14,92.94 180 bottom
C135  100n  [CAPC1005X55N]  108.5,68.9 180 bottom
C136  100n  [CAPC1005X55N]  103.9,60.1 180 bottom
C137  nc  [CAPC1005X55N]  100.14,95.48 180 bottom
C138  100n  [CAPC1005X55N]  183.1,83.5 270 top
C139  100n  [CAPC1005X55N]  178.8,83.5 270 top
C140  100n  [CAPC1005X55N]  173.6,81.1 0 top
C141  100n  [CAPC1005X55N]  173.6,77 0 top
C142  100n  [CAPC1005X55N]  173.6,74.2 0 top
C143  100n  [CAPC1005X55N]  190.35,75.05 180 top
C144  100n  [CAPC1005X55N]  184.8,77.8 180 bottom
C145  100n  [CAPC1005X55N]  176.2,70.1 90 top
C146  100n  [CAPC1005X55N]  179,70.1 90 top
C147  100n  [CAPC1005X55N]  183.9,72.5 270 bottom
C148  2.2u  [CAPC1608X95N]  177.6,73.2 270 bottom
C149  100n  [CAPC1005X55N]  196.8,63.5 180 bottom
C150  18p  [CAPC1005X55N]  189.3,71.4 90 bottom
C151  18p  [CAPC1005X55N]  189.3,68.4 270 bottom
C152  100n  [CAPC1005X55N]  196.8,81.5 180 bottom
C153  2.2u  [CAPC1608X95N]  173.1,79.6 0 top
C154  100n  [CAPC1005X55N]  173.6,78.2 0 top
C155  100n  [CAPC1005X55N]  186.9,80.2 180 top
C156  100n  [CAPC1005X55N]  173.6,73 0 top
C157  100n  [CAPC1005X55N]  184.2,70.1 90 top
C158  2.2u  [CAPC1608X95N]  181.6,70.2 90 bottom
C159  100n  [CAPC1005X55N]  109.9,66.7 90 top
C160  100n  [CAPC1005X55N]  112.8,58.8 270 top
C161  100n  [CAPC1005X55N]  117,79.9 180 bottom
C162  100n  [CAPC1005X55N]  104.2,80.4 0 bottom
C163  100n  [CAPC1005X55N]  109.2,75.2 270 bottom
C164  100n  [CAPC1005X55N]  112.2,75.1 270 bottom
C165  100n  [CAPC1005X55N]  113,92.3 90 top
C166  2.2u  [CAPC1608X95N]  111,88.6 180 top
C167  100n  [CAPC1005X55N]  111.2,86.3 180 bottom
C168  8p  [CAPC1005X55N]  112.8,71.5 0 bottom
C169  8p  [CAPC1005X55N]  115.4,71.5 180 bottom
C170  22n  [CAPC1005X55N]  111,69.1 270 bottom
C171  100n  [CAPC1005X55N]  111.2,72.6 270 top
C172  100n  [CAPC1005X55N]  120.96,55.98 270 top
C173  100n  [CAPC1005X55N]  102.7,69.9 90 top
C174  100n  [CAPC1005X55N]  111,65.2 270 top
C175  1u  [CAPC1608X95N]  117.17,58.54 0 top
C176  10u  [CAPC2013X100N]  109.33,59.15 90 top
C177  10n  [CAPC1005X55N]  111.4,57.6 45 bottom
C178  100p  [CAPC1005X55N]  107.2,62.4 90 top
C179  1u  [CAPC1608X95N]  107.5,67.4 180 top
C180  10u  [CAPC2013X100N]  112.8,70.5 270 top
C181  100n  [CAPC1005X55N]  149.1,113.6 270 bottom
C182  100n  [CAPC1005X55N]  158.2,116.5 0 bottom
C183  100n  [CAPC1005X55N]  124.8,40.4 180 bottom
C184  100n  [CAPC1005X55N]  123.4,49.6 270 bottom
C185  100n  [CAPC1005X55N]  117.05,110.07 180 bottom
C186  100n  [CAPC1005X55N]  114.5,119.3 270 bottom
C187  100n  [CAPC1005X55N]  112.1,95.2 270 bottom
C188  100n  [CAPC1005X55N]  108.3,95.2 270 bottom
C189  100n  [CAPC1005X55N]  124.6,10.1 180 bottom
C190  100n  [CAPC1005X55N]  123.1,19.2 270 bottom
C191  100n  [CAPC1005X55N]  135.5,57.3 180 bottom
C192  100n  [CAPC1005X55N]  132.6,66.3 270 bottom
C193  100n  [CAPC1005X55N]  160.8,18.5 90 bottom
C194  100n  [CAPC1005X55N]  151.5,15.7 180 bottom
C195  100n  [CAPC1005X55N]  196.8,45.5 180 bottom
C196  2u  [CAPC1608X95N]  8.5,119.4 90 top
C197  2u  [CAPC1608X95N]  8.6,96.4 90 top
C198  2u  [CAPC1608X95N]  13.9,89 90 top
C199  2u  [CAPC1608X95N]  13.9,112 90 top
C216  100n  [CAPC1005X55N]  163.1,64 180 top
C217  100n  [CAPC1005X55N]  160.2,68.7 270 top
C219  100n  [CAPC1005X55N]  150.5,66.5 270 top
C220  2.2u  [CAPC1608X95N]  157,65.2 90 top
CON1  ELEC  [PHOENIX381P900X920-2N]  73,6 90 bottom
CON2  SERVO  [PHOENIX381P900X920-2N]  73,16 90 bottom
CON3  LIPO_MOT  [PHOENIX381P900X920-2N]  73,124 90 bottom
CON4  LIPO_MOT  [PHOENIX381P900X920-2N]  73,115 90 bottom
CON5  LIPO_MOT  [PHOENIX381P900X920-2N]  73,106 90 bottom
CON6  LIPO_MOT  [PHOENIX381P900X920-2N]  73,97 90 bottom
CON7  FPGApower  [PHOENIX381P900X920-2N]  106.5,45 0 bottom
CON8  M0  [PHOENIX381P900X920-2N]  73,86 90 bottom
CON9  M3  [PHOENIX381P900X920-2N]  73,45.5 90 bottom
CON10  M5  [PHOENIX381P900X920-2N]  73,27.5 90 bottom
CON11  M2  [PHOENIX381P900X920-2N]  73,54.5 90 bottom
CON12  M4  [PHOENIX381P900X920-2N]  73,36.5 90 bottom
CON13  M1  [PHOENIX381P900X920-2N]  73,68 90 bottom
CON14  ESC0  [PHOENIX381P1662X920-4N]  8,28 270 top
CON15  CON10_2_2.54  [CON245P2030X890-2X5N]  58.9,39.9 270 top
CON16  CON10_2_2.54  [CON245P2030X890-2X5N]  124,59.9 270 top
CON17  ESC1  [PHOENIX381P1662X920-4N]  8,62 270 top
CON18  UART0  [CON254P1270X400-5S]  156.66,125.33 180 bottom
CON19  QEI1  [CON254P1270X400-5S]  90.62,4.67 0 bottom
CON20  AN0  [CON254P762X400-3SMT]  93.8,56.11 180 bottom
CON21  S0  [CON254P762X400-3SMT]  93.8,33.25 180 bottom
CON22  IO0  [CON254P762X400-3SMT]  93.8,78.97 180 bottom
CON23  AN1  [CON254P762X400-3SMT]  93.8,58.65 180 bottom
CON24  S1  [CON254P762X400-3SMT]  93.8,35.79 180 bottom
CON25  IO1  [CON254P762X400-3SMT]  93.8,81.51 180 bottom
CON26  UART1  [CON254P1270X400-5S]  156.66,4.67 0 bottom
CON27  QEI0  [CON254P1270X400-5S]  90.62,125.33 180 bottom
CON28  AN2  [CON254P762X400-3SMT]  93.8,61.19 180 bottom
CON29  S2  [CON254P762X400-3SMT]  93.8,38.33 180 bottom
CON30  IO2  [CON254P762X400-3SMT]  93.8,84.05 180 bottom
CON31  TELEM  [CON254P1270X400-5S]  143.96,125.33 180 bottom
CON32  QEI3  [CON254P1270X400-5S]  103.32,4.67 0 bottom
CON33  AN3  [CON254P762X400-3SMT]  93.8,63.73 180 bottom
CON34  S3  [CON254P762X400-3SMT]  93.8,40.87 180 bottom
CON35  IO3  [CON254P762X400-3SMT]  93.8,86.59 180 bottom
CON36  BALISE  [CON254P1270X400-5S]  143.96,4.67 0 bottom
CON37  AN4  [CON254P762X400-3SMT]  93.8,66.27 180 bottom
CON38  S4  [CON254P762X400-3SMT]  93.8,43.41 180 bottom
CON39  IO4  [CON254P762X400-3SMT]  93.8,89.13 180 bottom
CON40  SPI0  [CON254P1524X400-6N-S]  129.99,125.33 180 bottom
CON41  QEI2  [CON254P1270X400-5S]  103.32,125.33 180 bottom
CON42  AN5  [CON254P762X400-3SMT]  93.8,68.81 180 bottom
CON43  S5  [CON254P762X400-3SMT]  93.8,45.95 180 bottom
CON44  IO5  [CON254P762X400-3SMT]  93.8,91.67 180 bottom
CON45  SPI1  [CON254P1524X400-6N-S]  129.99,4.67 0 bottom
CON46  AN6  [CON254P762X400-3SMT]  93.8,71.35 180 bottom
CON47  S6  [CON254P762X400-3SMT]  93.8,48.49 180 bottom
CON48  IO6  [CON254P762X400-3SMT]  93.8,94.21 180 bottom
CON49  I2C0  [CON254P1270X400-5S]  116.02,125.33 180 bottom
CON50  AN7  [CON254P762X400-3SMT]  93.8,73.89 180 bottom
CON51  S7  [CON254P762X400-3SMT]  93.8,51.03 180 bottom
CON52  IO7  [CON254P762X400-3SMT]  93.8,96.75 180 bottom
CON53  I2C1  [CON254P1270X400-5S]  116.02,4.67 0 bottom
CON54  USB2  [USB_A]  198.8,67 0 top
CON55  USB3  [USB_A]  198.8,85 0 top
CON56  USBfpga  [CON254P762X400-3N-S]  182.5,63.6 180 top
CON57  FPGA_GPIO0  [CON254P5080X600-40N]  150.56,96.5 0 top
CON58  FPGA_GPIO1  [CON254P5080X600-40N]  150.56,33.5 180 top
CON59  FPGA_LTC  [CON200P1700X400-2X7N]  192.28,96.01 180 top
CON60  USB3  [USB_A]  198.8,49 0 top
CON61  CON5_2.54S  [CON254P1270X400-5S]  16.5,92 270 top
CON62  CON5_2.54S  [CON254P1270X400-5S]  6.5,92 270 top
CON63  CON5_2.54S  [CON254P1270X400-5S]  16.5,115 270 top
CON64  CON5_2.54S  [CON254P1270X400-5S]  6.5,115 270 top
D1  SMP12A  [DO220AA]  76.9,8.8 90 top
D2  SMP12A  [DO220AA]  76.8,17.2 90 bottom
D3  SMAJ51A  [D0214AC]  79,120 0 bottom
D4  LED_603  [LEDC1608X60N]  176,6 270 top
D5  LED_603  [LEDC1608X60N]  179,6 270 top
D6  LED_603  [LEDC1608X60N]  172.9,6 270 top
D7  LED_603  [LEDC1608X60N]  167,6 270 top
D8  LED_603  [LEDC1608X60N]  170,6 270 top
D9  LED_603  [LEDC1608X60N]  179.2,118.4 0 top
D10  LED_603  [LEDC1608X60N]  178.7,19 0 top
IC1  ADS1258  [QFN48]  111,63 270 bottom
IC2  ADS1278  [TQFP64_POWERPAD]  110.7,80.8 180 top
IC3  REF5030I  [MSOP8_0.65]  117.15,55.88 180 top
IC4  REF5025I  [MSOP8_0.65]  106.6,70.1 0 top
J1  NC  [JUMC1608X50AN]  77.8,14.1 270 top
J2  nc  [JUMC1005X50N]  97,100.1 90 top
J3  0  [JUMC1005X50N]  95.5,99 180 bottom
J4  0  [JUMC1608X50AN]  81.2,44.9 180 bottom
J5  nc  [JUMC1608X50AN]  83,54.8 315 bottom
J6  0  [JUMC1608X50AN]  81.3,26.8 180 bottom
J7  nc  [JUMC1608X50AN]  82.4,37.3 270 bottom
J8  0  [JUMC1005X50N]  96.8,84.1 180 top
J9  0  [JUMC1005X50N]  96.8,90.6 180 top
J10  0  [JUMC1005X50N]  96.8,89.4 180 top
J11  0  [JUMC1005X50N]  96.8,88.2 180 top
J12  0  [JUMC1005X50N]  96.8,47.1 180 top
J13  0  [JUMC1005X50N]  96.8,53.7 180 top
J14  0  [JUMC1005X50N]  96.8,29.1 180 top
J15  0  [JUMC1005X50N]  96.8,35.7 180 top
J16  0  [JUMC1005X50N]  96.8,52.3 180 top
J17  0  [JUMC1005X50N]  96.8,51.2 180 top
J18  0  [JUMC1005X50N]  96.8,34.3 180 top
J19  0  [JUMC1005X50N]  96.8,33.2 180 top
J20  0  [JUMC1005X50N]  96.8,66.1 180 top
J21  0  [JUMC1005X50N]  96.8,72.6 180 top
J22  0  [JUMC1005X50N]  96.8,71.4 180 top
J23  0  [JUMC1005X50N]  96.8,70.2 180 top
J24  nc  [JUMC1608X50AN]  32.4,44.1 0 top
J25  0  [JUMC1608X50AN]  32.4,35.7 0 top
J26  0  [JUMC1005X50N]  60.8,13.2 270 top
J27  nc  [JUMC1005X50N]  51.2,49.5 0 bottom
J28  nc  [JUMC1005X50N]  105.1,84.1 180 bottom
J29  0  [JUMC1005X50N]  105.1,85.3 0 bottom
J30  nc  [JUMC1005X50N]  109.7,72.5 90 top
J31  0  [JUMC1005X50N]  112.8,56.23 180 top
J32  0  [JUMC1005X50N]  110.8,69.8 0 top
J33  nc  [JUMC1005X50N]  158.2,117.8 180 bottom
J34  0  [JUMC1005X50N]  157.8,114.8 270 bottom
J35  nc  [JUMC1005X50N]  122.1,49.6 90 bottom
J36  0  [JUMC1005X50N]  124.7,49.5 270 bottom
J37  nc  [JUMC1005X50N]  115.9,121.6 90 bottom
J38  0  [JUMC1005X50N]  115.9,119.3 270 bottom
J39  nc  [JUMC1005X50N]  110.3,94.7 180 bottom
J40  0  [JUMC1005X50N]  110.3,95.9 180 bottom
J41  nc  [JUMC1005X50N]  121.8,19.2 90 bottom
J42  0  [JUMC1005X50N]  124.5,19.2 270 bottom
J43  nc  [JUMC1005X50N]  133.8,66.3 90 bottom
J44  0  [JUMC1005X50N]  135,66.3 270 bottom
J45  nc  [JUMC1005X50N]  151.5,16.9 0 bottom
J46  0  [JUMC1005X50N]  151.5,18.3 180 bottom
J47  FPGA_ADC  [2X5_NOSILK]  196.3,33.66 270 top
J48  NC  [JUMC1005X50N]  187.1,20.6 180 top
J49  NC  [JUMC1005X50N]  187.1,23.6 180 top
J50  0  [JUMC1005X50N]  158.9,68.7 270 top
J51  0  [JUMC1005X50N]  157.6,68.7 90 top
K1  RELAY_V23101-SMT  [V23101-D0103-A201-SMT]  20.6,23 90 top
K2  RELAY_V23101-SMT  [V23101-D0103-A201-SMT]  13,19 270 top
K3  RELAY_V23101-SMT  [V23101-D0103-A201-SMT]  20.6,60 90 top
K4  RELAY_V23101-SMT  [V23101-D0103-A201-SMT]  13,56 270 top
L1  SRN2512-R24M  [INDC2520X120N]  76,81.5 0 top
L2  SRN2512-R24M  [INDC2520X120N]  77.1,84.6 0 top
L3  SRN2512-R24M  [INDC2520X120N]  72.8,92.1 270 top
L4  SRN2512-R24M  [INDC2520X120N]  76,92.1 270 top
L5  SRN2512-R24M  [INDC2520X120N]  76,63.5 0 top
L6  SRN2512-R24M  [INDC2520X120N]  77.1,66.6 0 top
L7  SRN2512-R24M  [INDC2520X120N]  72.8,73.5 270 top
L8  SRN2512-R24M  [INDC2520X120N]  76,74.1 270 top
L9  600  [INDC1608X95N]  176.1,73.2 270 bottom
L10  600  [INDC1608X95N]  178.3,70.4 180 bottom
Q1  25MHz  [XTAL500X320X130N]  186.6,69.9 270 bottom
Q2  32.768kHz  [1206]  114.1,69.6 180 bottom
R1  100k  [RESC1005X40N]  114.4,22.3 90 top
R2  100k  [RESC1005X40N]  119.9,22.3 90 top
R3  100k  [RESC1005X40N]  118.3,22.3 90 top
R4  100k  [RESC1005X40N]  116,22.3 90 top
R5  5k  [RESC1005X40N]  114.4,24.6 90 top
R6  5k  [RESC1005X40N]  119.9,24.6 90 top
R7  5k  [RESC1005X40N]  118.3,24.6 90 top
R8  5k  [RESC1005X40N]  116,24.6 90 top
R9  240  [RESC1005X40N]  98.4,17.5 180 bottom
R10  560  [RESC1005X40N]  176,9 270 top
R11  560  [RESC1005X40N]  179,9 270 top
R12  560  [RESC1005X40N]  172.9,9 270 top
R13  560  [RESC1005X40N]  167,9 270 top
R14  5k  [RESC1005X40N]  170,9 270 top
R15  100k  [RESC1005X40N]  170.6,22.4 90 top
R16  32k  [RESC1005X40N]  169.3,22.4 90 top
R17  100k  [RESC1005X40N]  108.5,18.3 90 top
R18  19k  [RESC1005X40N]  107.3,18.3 90 top
R19  100k  [RESC1005X40N]  106.1,27.6 90 top
R20  19k  [RESC1005X40N]  104.9,27.6 90 top
R21  10k  [RESC1005X40N]  72.6,49.4 0 top
R22  10k  [RESC1005X40N]  70.4,32.6 90 top
R23  ULR15S-R0055FT2  [RESC_ULR15S-R0055FT2]  76.9,44.5 270 top
R24  ULR15S-R0055FT2  [RESC_ULR15S-R0055FT2]  69.2,90.9 270 top
R25  ULR15S-R0055FT2  [RESC_ULR15S-R0055FT2]  76.9,26.9 270 top
R26  30k  [RESC1005X40N]  96.8,85.5 0 top
R27  10k  [RESC1005X40N]  74.5,79.2 0 top
R28  30k  [RESC1005X40N]  96.8,48.5 0 top
R29  ULR15S-R0055FT2  [RESC_ULR15S-R0055FT2]  76.9,55.5 90 top
R30  30k  [RESC1005X40N]  96.8,30.5 0 top
R31  10k  [RESC1005X40N]  72.6,50.6 0 top
R32  ULR15S-R0055FT2  [RESC_ULR15S-R0055FT2]  69.2,72.27 270 top
R33  30k  [RESC1005X40N]  96.8,67.5 0 top
R34  10k  [RESC1005X40N]  74.5,76.8 0 top
R35  10k  [RESC1005X40N]  55.01,38.55 180 bottom
R36  ULR15S-R0055FT2  [RESC_ULR15S-R0055FT2]  50,37.1 180 top
R37  10k  [RESC1005X40N]  55.6,41.5 270 bottom
R38  ULR15S-R0055FT2  [RESC_ULR15S-R0055FT2]  50,42.7 180 top
R39  1k  [RESC1005X40N]  90.6,6.5 90 top
R40  1k  [RESC1005X40N]  93.2,6.5 90 top
R41  10k  [RESC1005X40N]  100.14,56.11 180 bottom
R42  1k  [RESC1005X40N]  100.14,78.97 180 bottom
R43  10k  [RESC1005X40N]  100.14,57.28 0 bottom
R44  20k  [RESC1005X40N]  110.7,53.6 270 bottom
R45  0.01  [RESC1608X50AN]  88.08,33.25 0 bottom
R46  10k  [RESC1005X40N]  100.14,58.65 180 bottom
R47  1k  [RESC1005X40N]  100.14,81.51 180 bottom
R48  10k  [RESC1005X40N]  100.14,59.82 0 bottom
R49  20k  [RESC1005X40N]  109.4,53.6 270 bottom
R50  1k  [RESC1005X40N]  90.6,123.5 270 top
R51  1k  [RESC1005X40N]  88.1,123.5 270 top
R52  0.01  [RESC1608X50AN]  88.08,35.79 0 bottom
R53  10k  [RESC1005X40N]  100.14,61.19 180 bottom
R54  1k  [RESC1005X40N]  100.14,84.05 180 bottom
R55  10k  [RESC1005X40N]  100.14,62.36 0 bottom
R56  20k  [RESC1005X40N]  108.1,53.6 270 bottom
R57  0.01  [RESC1608X50AN]  88.08,38.33 0 bottom
R58  1k  [RESC1005X40N]  100.8,7.2 270 bottom
R59  10k  [RESC1005X40N]  100.14,63.73 180 bottom
R60  560  [RESC1005X40N]  100.14,86.59 180 bottom
R61  1k  [RESC1005X40N]  103.4,7.2 270 bottom
R62  1k  [RESC1005X40N]  105.9,7.2 270 bottom
R63  10k  [RESC1005X40N]  100.14,64.9 0 bottom
R64  20k  [RESC1005X40N]  106.8,53.6 270 bottom
R65  0.01  [RESC1608X50AN]  88.08,40.87 0 bottom
R66  10k  [RESC1005X40N]  100.14,66.27 180 bottom
R67  1k  [RESC1005X40N]  100.14,89.13 180 bottom
R68  10k  [RESC1005X40N]  100.14,67.44 0 bottom
R69  20k  [RESC1005X40N]  105.5,53.6 270 bottom
R70  0.01  [RESC1608X50AN]  88.08,43.41 0 bottom
R71  1k  [RESC1005X40N]  107,122.8 90 bottom
R72  1k  [RESC1005X40N]  104.5,122.8 90 bottom
R73  1k  [RESC1005X40N]  102,122.8 90 bottom
R74  10k  [RESC1005X40N]  100.14,68.81 180 bottom
R75  1k  [RESC1005X40N]  100.14,91.67 180 bottom
R76  10k  [RESC1005X40N]  100.14,69.98 0 bottom
R77  20k  [RESC1005X40N]  104.2,53.6 270 bottom
R78  0.01  [RESC1608X50AN]  88.08,45.95 0 bottom
R79  10k  [RESC1005X40N]  100.14,71.35 180 bottom
R80  560  [RESC1005X40N]  100.14,94.21 180 bottom
R81  10k  [RESC1005X40N]  100.14,72.52 0 bottom
R82  20k  [RESC1005X40N]  102.9,53.6 270 bottom
R83  0.01  [RESC1608X50AN]  88.08,48.49 0 bottom
R84  10k  [RESC1005X40N]  100.14,73.89 180 bottom
R85  560  [RESC1005X40N]  100.14,96.75 180 bottom
R86  10k  [RESC1005X40N]  100.14,75.06 0 bottom
R87  20k  [RESC1005X40N]  101.6,53.6 270 bottom
R88  0.01  [RESC1608X50AN]  88.08,51.03 0 bottom
R89  10k  [RESC1005X40N]  186.9,79.1 0 top
R90  1M  [RESC1005X40N]  183.8,69.9 90 bottom
R91  10k  [RESC1005X40N]  182.8,121.4 180 top
R92  330  [RESC1005X40N]  182.7,118.4 180 top
R93  10k  [RESC1005X40N]  183,29.6 0 bottom
R94  330  [RESC1005X40N]  181.5,19 180 top
R95  12.4k  [RESC1005X40N]  177.4,70.1 90 top
R96  12k  [RESC1005X40N]  185.4,70.7 90 top
R97  10k  [RESC1005X40N]  106.1,64.85 90 top
R98  1M  [RESC1005X40N]  107.2,64.6 270 top
R99  50k  [RESC1005X40N]  118.5,123 270 bottom
R100  50k  [RESC1005X40N]  119.8,123 270 bottom
R101  50k  [RESC1005X40N]  154.4,93.1 270 top
R102  50k  [RESC1005X40N]  151.9,93.1 270 top
R103  50k  [RESC1005X40N]  120.7,7.3 90 bottom
R104  50k  [RESC1005X40N]  119.4,7.3 90 bottom
R105  50k  [RESC1005X40N]  149.3,30.2 270 top
R106  50k  [RESC1005X40N]  144.2,30.2 270 top
R107  10k  [RESC1005X40N]  8.6,99.3 270 top
R108  10k  [RESC1005X40N]  8.6,93.4 270 top
R109  10k  [RESC1005X40N]  9.1,114.6 270 top
R110  10k  [RESC1005X40N]  8.6,116.7 270 top
T1  MOSFET_NTR5198NL  [SOT95P290X130-3N]  100.2,118.5 90 top
T2  MOSFET_NTR5198NL  [SOT95P290X130-3N]  40,48.1 0 bottom
T3  MOSFET_NTR5198NL  [SOT95P290X130-3N]  40,52.1 0 bottom
U1  SN74LV4052A_SO  [SOIC127P780X200-16N]  116.52,32.85 270 top
U2  BUZZER  [BUZZER_CIRCLE]  97,111 90 bottom
U3  PTR08100W  [PTR08100W]  95.7,14.1 270 top
U4  TPS82130  [SON65P310X290X153-9N]  169.3,19.5 90 top
U5  TPS82130  [SON65P310X290X153-9N]  107.3,15.4 90 top
U6  TPS82130  [SON65P310X290X153-9N]  104.9,24.6 90 top
U7  INA240-A2  [TSSOP]  68.6,45.4 90 top
U8  INA240-A2  [TSSOP]  68.6,27.4 90 top
U9  DRV8432  [R-PDSO-G36]  87.5,87 90 top
U10  DRV8432  [R-PDSO-G36]  87.5,50 90 top
U11  DRV8432  [R-PDSO-G36]  87.5,32 90 top
U12  INA240-A2  [TSSOP]  68.5,84.3 270 top
U13  INA240-A2  [TSSOP]  68.5,53.6 270 top
U14  DRV8432  [R-PDSO-G36]  87.5,69 90 top
U15  INA240-A2  [TSSOP]  69.7,77.9 0 top
U16  INA240-A2  [TSSOP]  50,37 180 bottom
U17  ESC_TURNIGY40A  [ESC_TURNIGY40A]  26.3,31.2 180 top
U18  INA240-A2  [TSSOP]  50,43 180 bottom
U19  ESC_CHINOI15A  [ESC_CHINOI15A]  25.5,67 180 top
U20  LAN9514  [QFN50P900X900X100-65N]  180.3,76.8 180 top
U21  LGA22U  [LGA22U]  184.7,122.4 270 top
U22  LGA22U  [LGA22U]  184.7,30.6 270 top
U23  LP5900_2.2  [SON65P250X220X80-7N]  111,91.1 0 top
U24  OPA376  [SC70-5N]  109.2,63.3 180 top
U25  TXS0108PWR  [SOP65P640X110-20N]  153.3,114.8 0 bottom
U26  TXB0108PWR  [SOP65P640X110-20N]  123.7,44.7 270 bottom
U27  TXS0108PWR  [SOP65P640X110-20N]  116.02,114.31 270 bottom
U28  TXB0108PWR  [SOP65P640X110-20N]  110.2,90.4 270 bottom
U29  FPGA_ARDUINO  [ARDUINOR3]  108.88,38.38 0 top
U30  TXS0108PWR  [SOP65P640X110-20N]  123.4,14.3 270 bottom
U31  TXB0108PWR  [SOP65P640X110-20N]  134.3,61.5 270 bottom
U32  TXS0108PWR  [SOP65P640X110-20N]  156.3,17.4 180 bottom
U33  VL53L0X  [VL53L0X]  11.5,99 0 top
U34  TCA6408A  [QFN50P300X300X80-17N]  11.9,93.7 270 top
U35  LP5900SD-2.8  [SON65P250X220X80-7N]  11.2,89.3 180 top
U36  VL6180X  [VL6180X]  11.5,121.8 180 top
U37  MPU-9250  [QFN24-3X3]  160,65 180 top
U38  LP5900_3  [SON65P250X220X80-7N]  153.6,66.7 90 top
U39  TCA6408A  [QFN50P300X300X80-17N]  11.9,116.7 270 top
U40  LP5900SD-2.8  [SON65P250X220X80-7N]  11.2,112.3 180 top

## Tracks (layer width: path | path; a pad name or v marks a point on that pad's centre or on a via)
3V3  (via drill 0.3 pad 0.65)
  Top 0.2: U20.27 179.05,81.95 v178.8,82.2 | U20.28 178.55,81.95 v178.8,82.2 | U20.19 183.05,82.15 v183.1,82.2 C138.2 | U20.33 174.95,80.55 v174.9,80.6 174.6,80.9 174.3,80.9 174.1,81.1 C140.2 | U20.41 175.35,76.55 v174.9,77 | U20.40 174.95,77.05 v174.9,77 | U20.39 175.45,77.55 v174.9,77 | U20.46 174.95,74.05 v174.9,74.1 174.8,74.2 C142.2 | U20.11 185.35,78.05 185.7,78.4 186.9,78.4 v187.1,78.2 187.2,78.3 187.2,78.92 R89.2 | C141.2 v174.9,77 | C139.2 v178.8,82.2 | R91.2 182.32,119.38 | 182.32,119.38 182.4,119.3 187.3,119.3 189.2,117.4 189.2,111 v187.6,109.4 | D9.A 179.3,119.3 182.24,119.3 182.32,119.38
  Top 0.3: D10.A 177.9,17.6
  Top 0.5: U4.P$4 170.55,18.45 171,18.9 171,20.7 170.43,20.7 U4.P$5 170.6,20.88 R15.1
  Top 0.8: U21.P$6 v187.6,109.4
  Top 1: 171,20.7 172.2,20.7 | 172.2,20.7 C17.P$1 | 172.2,20.7 173,20.7 176.1,17.6 177.9,17.6 U22.P$6
  Top 1.2: C17.P$1 v172.5,22.5
  Bottom 0.2: R93.2 179.2,29.6 177.3,31.5
  Bottom 0.4: v174.9,74.1 v174.9,77 174.2,77.7 174.2,79.9 v174.9,80.6 176.5,82.2 v178.8,82.2 v183.1,82.2 185.1,82.2 187.1,80.2 v187.1,78.2
  Bottom 0.6: L9.1 176,74.1 v174.9,74.1
  Bottom 1: v187.6,109.4 179.2,101 179.2,90.1 170.5,81.4 170.5,74.1 v174.9,74.1
  Bottom 1.2: C18.+ 172.5,25 v172.5,22.5 v172.5,21.7
  Bottom 2: 170.5,74.1 170.5,53.8 177.3,47 177.3,31.5 177.3,31 172.7,26.4 C18.+
5V  (via drill 0.3 pad 0.65, 0.35 pad 0.65)  (1 unrouted)
  Top 0.2: C28.2 70.8,49.73 v70.8,50.9 70.3,50.9 U13.P$5 | U7.P$5 67,47.3 67.4,46.9 v67.4,46.6 | U8.P$5 67.1,30 67.1,31 v67.3,31.2 C46.2 | U12.P$5 70.1,81.2 v70.9,80.4 | U15.P$5 71.8,79.5 v70.9,80.4 | C37.2 71.42,80.92 v70.9,80.4 | R17.1 108.28,17.59 U5.P$5 | IC2.5 v117.5,79.05 | IC4.2 104.92,70.42 107.5,67.85 107.5,66.8 107.7,66.6 109.2,66.6 109.78,67.18 C159.2 | R40.2 R39.2 86.68,6.98 85.72,6.02 C103.2 | CON26.4 158.93,9.48 R13.1 | R51.2 R50.2 94.62,123.02 95.58,123.98 C109.2
  Top 0.25: IC2.53 108.95,74.15 v109.2,73.9 | IC2.60 112.45,74.15 v112.2,73.9 | IC2.44 104.25,79.05 v103.7,79.6 | U23.6 110.35,92.65 v111,93.3 111.1,93.3 111.6,92.8 | U23.4 111.65,92.75 111.6,92.8 | 111.6,92.8 112.98,92.8 C165.2
  Top 0.4: U5.P$4 108.35,14.35 109.1,15.1 | U5.P$5 108.95,16.45 109.1,16.3 | U24.P$5 109.85,62.95 111,64.1 C174.2 111.22,64.72 111.8,65.3 111.8,66.5 v110.6,67.7 110.08,67.18 C159.2 | IC3.2 120.91,55.55 C172.2 121,55.5 121.3,55.2 122.3,55.2 122.68,54.82 CON16.P$9 | IC4.2 102.75,70.42 C173.2 | C103.2 85.5,4.72 CON19.5 | C118.2 98.2,4.72 CON32.5 | 95.58,123.98 95.7,124.1 CON27.5 | C125.2 CON41.5
  Top 1: 109.1,15.1 109.1,16.3 C21.P$1 111.2,16.8 v111.8,16.8 v112.5,16.8 v113.2,16.8
  Route2 0.2: v115.9,123 115.9,123.7
  Route2 0.3: 119.5,67.5 v133.8,67.5
  Route2 0.4: v117.5,79.05 119.5,79.05 | v111,93.3 111.1,93.4 119.5,93.4 | v150.3,16.9 154.12,13.08 CON26.4
  Route2 0.6: v70.8,50.9 67.4,50.9 | v67.3,31.2 67.4,31.3 | v70.9,80.4 67.4,76.9 | CON16.P$9 122.71,54.8 119.5,54.8 119.5,55.2
  Route2 1: 67.4,76.9 67.4,50.9 v67.4,46.6 67.4,31.3 71.1,27.6 80.2,27.6 81.2,26.6 99.6,26.6 107.9,18.3 112.5,18.3 | v110.6,67.7 111.3,67 119.5,67 | CON19.5 87.17,6.3 98.2,6.3 | 98.2,6.3 111,6.3 111,4.73 CON53.5 112.61,3 123.6,3 | CON32.5 98.2,4.72 98.2,6.3 | CON27.5 97.33,123.7 108.4,123.7 | 108.4,123.7 115.9,123.7 119.5,123.7 | 119.5,123.7 121.1,123.7 | 121.1,123.7 136.3,123.7 | CON40.6 136.34,123.74 136.3,123.7 | CON49.5 121.1,123.7 | CON41.5 108.4,123.7 | 119.5,122.7 119.5,123.7 | 136.3,123.7 144.88,123.7 CON31.4 148.18,127 157.53,127 CON18.4 | CON26.4 152.44,3 123.6,3 | CON45.6 123.64,3.04 123.6,3
  Route2 1.5: v99,54.5 v99.7,54.5 v100.4,54.5 100.8,54.5 101.6,53.7 117.1,53.7 117.1,52.8
  Route2 2: 111,6.3 111,17.8 112,16.8 v112.5,16.8 | 194.2,52.6 194.2,49.3 198,45.5 CON60.1 | 194.2,52.6 124.1,52.6 122.7,54 122.7,54.8 122.6,54.9 119.2,54.9 117.1,52.8 | CON55.1 194.2,76.9 194.2,63.5 | CON54.1 194.2,63.5 | 194.2,52.6 194.2,63.5
  Route2 3: 119.5,122.7 119.5,93.4 119.5,79.05 119.5,67.5 119.5,67 119.5,55.2 117.1,52.8 117.1,22.9 112.5,18.3 v112.5,16.8
  Bottom 0.2: U18.P$5 52,41.4 51.4,40.8 51.4,39.92 C93.1 51.4,39.88 51.4,39.7 51,39.3 51,36.3 51.9,35.4 U16.P$5 53.1,35.4 54.58,33.92 C98.1 56.51,33.7 CON15.P$9 | CON52.2 95.08,98.03 J3.P$1 | J43.P$2 v133.8,67.5 | J41.P$2 121.62,19.62 121,19 115.4,19 v113.2,16.8 | J45.P$2 v150.3,16.9 | CON16.P$9 122.73,50.65 J35.P$2 | J33.P$2 159.2,118.38 CON18.4 | J37.P$2 v115.9,123
  Bottom 0.25: C163.2 v109.2,73.9 | v112.2,73.9 C164.2 | J39.P$2 110.72,94.68 110.9,94.5 110.9,93.2 v111,93.3 | IC1.6 110.75,67.55 v110.6,67.7
  Bottom 0.3: C195.2 CON60.1
  Bottom 0.4: 110.7,79.05 110.15,79.6 v103.7,79.6 103.72,79.58 C162.2 | 110.7,79.05 v117.5,79.05 117.48,79.07 C161.2 | 110.7,79.05 110.7,75.9 | 110.7,75.9 109.52,74.72 C163.2 | C164.2 111.98,74.62 110.7,75.9 | C152.2 CON55.1 | C149.2 CON54.1
  Bottom 1: 111.8,15.4 v111.8,16.8 v113.2,16.8 111.8,15.4 | 111.8,15.4 C22.+
  Bottom 1.2: CON52.2 CON48.2 CON44.2 CON39.2 CON35.2 CON30.2 CON25.2 CON22.2 CON50.2 CON46.2 CON42.2 CON37.2 CON33.2 CON28.2 CON23.2 CON20.2 95.4,54.5 v100.4,54.5
12V
  Top 0.2: R1.1 114.28,21.82 114,22.1 105.1,22.1 104.3,22.9
  Top 0.4: U6.P$2 104.58,23.17 104.3,22.9 | U6.P$1 103.92,22.98 104,22.9 | U5.P$2 106.97,13.98 106.7,13.7 | U5.P$1 106.33,13.73 106.3,13.7 | U4.P$2 168.97,17.88 168.7,17.6 | U4.P$1 168.32,17.62 168.3,17.6
  Top 0.6: D1.C 76.9,10.1 | C1.1 76.3,10.1 | CON36.4 141.42,11.18 141.4,11.2
  Top 1: J1.P$2 77.8,10.1 | C24.P$1 102,23.2 | 104.3,22.9 104,22.9 102,22.9 | 102,14.3 102.2,14.5 C20.P$1 105.2,13.7 106.3,13.7 106.7,13.7 | 168.7,17.6 168.3,17.6 C16.P$1
  Top 1.2: 102,11.2 141.4,11.2 159.7,11.2 C16.P$1
  Top 2: CON1.P$2 75.19,10.1 76.3,10.1 76.9,10.1 77.8,10.1 82.8,10.1 C2.+ 84.4,8.5 99.3,8.5 102,11.2 102,14.3 102,22.9 102,23.2
24V  (via drill 0.3 pad 0.65, 0.35 pad 0.65, 0.5 pad 1, 1.1 pad 1.6)  (1 unrouted)
  Top 0.2: R4.1 116,21.2 | 116,21.2 112.2,21.2 v111.9,21.5 | 116,21.2 116.7,20.5 156,20.5 v161.2,15.3 | v164.6,11.9 167.58,11.9 R14.1
  Top 0.4: U9.P$34 82.2,82.78 v82.2,82.8 | U9.P$29 82.2,86.03 v82.2,86 | U9.P$21 82.2,91.22 v82.2,91.2 | U9.P$26 82.2,87.97 v82.2,88 | U14.P$21 82.17,73.22 v82.2,73.2 | U14.P$26 82.17,69.97 v82.2,70 | U14.P$29 82.17,68.03 v82.2,68 | U14.P$34 82.17,64.78 v82.2,64.8
  Top 0.6: v82.9,82.8 v82.2,82.8 | v82.9,86 v82.2,86 | v82.9,88 v82.2,88 | v82.9,91.2 v82.2,91.2 | v82.2,73.2 v82.9,73.2 | v82.2,70 v82.9,70 | v82.9,68 v82.2,68 | v82.9,64.8 v82.2,64.8
  Top 1: 31.3,44.6 31.3,44.52 J24.P$1
  Top 2: v31.3,48.7 31.3,44.6
  Route2 0.2: v83.4,38 91,30.4 103,30.4 v111.9,21.5
  Route15 1: v31.3,48.7 v31.3,47.6
  Route15 4: v13.3,76 31.3,58 v31.3,48.7
  Bottom 0.2: C11.P$1 77,122.8 | v83.4,38 82.42,38 J7.P$1 | v161.2,15.3 v164.6,11.9 | 80.3,96 80.45,96.15 | 82.17,64.78 v82.2,64.8
  Bottom 0.4: C12.+ 80.3,97.9
  Bottom 0.6: C77.P$2 82,65 v82.2,64.8 | C78.P$2 82,67.8 v82.2,68 | C79.P$2 82,70.2 v82.2,70 | C80.P$2 82,73 v82.2,73.2 | C33.P$2 82,83 v82.2,82.8 | C34.P$2 82,85.8 v82.2,86 | C35.P$2 82,88.2 v82.2,88 | C36.P$2 82,91 v82.2,91.2
  Bottom 1: 82.4,38.2 J7.P$1 | J5.P$1 83.48,55.38 83.6,55.5
  Bottom 1.5: 82.17,64.78 82.17,56.92 83.6,55.5 84.9,54.2 84.9,42.2 82.4,39.7 82.4,38.2
  Bottom 2: v82.2,64.8 v82.2,68 v82.2,70 v82.2,73.2 v82.2,82.8 v82.2,86 v82.2,88 v82.2,91.2 82.2,94.4 | v78.3,96 80.3,96 | D3.C 77,120
  Bottom 3: CON3.P$2 74.59,125.91 77,123.5 77,122.8 77,120 77,103.7 80.3,100.4 C12.+ 80.3,96.3 80.45,96.15 82.2,94.4
A5V  (via drill 0.3 pad 0.65)  (1 unrouted)
  Top 0.2: R2.1 v119.9,21.1 120.1,20.9 156.2,20.9 160.9,16.2 v161.2,16.2 | v164.5,12.9 165.1,12.3 167.8,12.3 169.9,10.2 172.18,10.2 R12.1
  Top 0.4: K3.11 14.8,60.72 14.8,55.26 K4.2 | K1.2 22.3,23.84 22.3,18.14 K2.11 19.06,14.9 9.6,14.9 3.8,20.7 3.8,44.26 K4.2 | K4.2 14.46,52 46.2,52 47.6,50.6 v49.4,50.6 | J26.P$1 60.02,14.4 C94.1 59.9,15.32 59.9,32 61.9,34 61.9,43.25 CON15.P$2
  Bottom 0.2: U3.P$4 99.1,15.8 103.8,20.5 119.3,20.5 v119.9,21.1 | v161.2,16.2 v164.5,12.9
  Bottom 0.4: v49.4,50.6 51,50.6 51.5,50.1 51.5,49.62 J27.P$1 53.38,49.5 C99.1 55.63,49.52 CON15.P$2
  Bottom 0.6: C14.P$1 92.9,19.5 92.8,19.5
  Bottom 0.8: CON51.2 95.36,52.6 99.5,52.6 100.6,51.5 111.1,51.5 120.6,61 120.6,65.3 122,66.7 123.55,66.7 CON16.P$2
  Bottom 1: CON21.2 93.95,33.25 94.2,33
  Bottom 1.2: CON51.2 CON47.2 CON43.2 CON38.2 CON34.2 CON29.2 CON24.2 CON21.2
  Bottom 1.5: U3.P$4 93.7,15.8 93.4,16.1
  Bottom 2: 93.4,16.1 92.8,16.7 92.8,19.5 92.8,26.6 | 92.8,26.6 C15.+ | 94.2,33 94.2,28 92.8,26.6
A12V  (via drill 0.3 pad 0.65, 0.35 pad 0.65, 0.45 pad 0.75, 1.1 pad 1.6)  (1 unrouted)
  Top 0.2: J2.P$1 97,96.3 C40.P$2 | v118.3,21.1 R3.1
  Top 0.4: U9.P$19 79.78,92.53 v79.6,92.7 | U9.P$36 80.28,81.47 80.1,81.3 | U14.P$19 79.78,74.53 v79.6,74.7 | U14.P$36 80.28,63.48 80.1,63.3 | U10.P$19 79.53,55.52 v79.5,55.5 | U10.P$36 79.53,44.48 v79.5,44.5 | U11.P$36 79.62,26.48 v79.6,26.5 | U11.P$19 79.97,37.52 v79.7,37.8 | U9.P$1 94.62,81.47 94.8,81.3 94.8,80.6 C41.P$2 v92.5,80.3 | v92.4,93.3 92.5,93.3 92.8,93.6 94.3,93.6 C40.P$2 94.9,93.4 94.9,92.6 94.83,92.53 | U9.P$18 94.83,92.53 | U9.P$17 94.78,91.88 94.9,92 94.9,92.45 94.83,92.53 | 94.83,74.53 94.9,74.6 94.9,75.4 94.6,75.7 C82.P$2 v92.5,75.7 | 94.83,74.53 U14.P$18 | U14.P$17 94.78,73.88 94.9,74 94.9,74.45 94.83,74.53 | U14.P$1 94.72,63.48 94.9,63.3 94.9,62.6 C81.P$2 94.3,62.2 94.1,62.4 v92.6,62.4 | U10.P$18 94.83,55.52 | 94.83,55.52 94.9,55.6 94.9,56.4 C29.P$2 v92.5,56.8 | U10.P$17 94.78,54.88 94.9,55 94.9,55.45 94.83,55.52 | C30.P$2 94.9,43.7 94.9,44.3 94.72,44.48 U10.P$1 92.17,44.48 v92.2,44.5 | U11.P$18 94.83,37.52 | 94.83,37.52 94.9,37.6 94.9,38.3 C49.P$2 94.3,38.7 94.3,38.9 v92.6,38.9 | U11.P$17 94.78,36.88 94.9,37 94.9,37.45 94.83,37.52 | U11.P$1 94.83,26.48 95,26.3 95,25.7 C50.P$2 94.8,25.2 95.1,25.5 v95.4,25.5
  Top 0.6: C38.P$2 79.6,93.4 v79.6,92.7 | C39.P$2 80.1,80.5 80.1,81.3 v79.8,81 | C84.P$2 79.8,75.7 79.8,74.7 v79.6,74.7 | C83.P$2 80.3,62.5 80.1,62.5 80.1,63.3 v79.8,63 | C47.P$2 79.7,38.6 v79.7,37.8
  Top 1: 31.3,35.2 31.72,35.62 J25.P$1 | J1.P$1 74.67,17.91 CON2.P$2
  Top 2: v11,2.5 9.9,3.6 9.9,7.4 15.3,12.8 26.5,12.8 31.3,17.6 31.3,35.2
  Route2 0.6: v92.5,80.3 80.5,80.3 v79.8,81 | v92.4,93.3 91.8,92.7 v79.6,92.7 | v92.5,75.7 80.6,75.7 v79.6,74.7 | v92.6,62.4 92,63 v79.8,63 | v92.5,56.8 91.2,55.5 v79.5,55.5 | v92.2,44.5 v79.5,44.5 | v92.6,38.9 80.8,38.9 v79.7,37.8 | v95.4,25.5 80.6,25.5 v79.6,26.5
  Bottom 0.2: v95.4,25.5 100,20.9 118.1,20.9 v118.3,21.1
  Bottom 0.4: v79.8,81 78.7,81 | v79.6,74.7 78.7,74.7 | v79.8,63 78.7,63 | v79.5,55.5 78.7,55.5 | v79.5,44.5 78.7,44.5 | v79.6,26.5 78.2,26.5 | v79.7,37.8 78.2,37.8 | v76,22.51 v76,22.5
  Bottom 0.406: C31.P$2 78.7,56.5 78.7,56.4
  Bottom 0.6: C48.P$2 78.2,25.3 | D2.C 76.8,18.7 | C5.1 76,21.1
  Bottom 1: v79.6,92.7 78.7,91.8 78.7,81 78.7,74.7 78.7,63 78.7,56.4 78.7,55.5 78.7,44.9 | 78.7,44.9 78.7,44.5 | J4.P$1 78.7,44.9 | J6.P$1 78.3,26.8 78.2,26.9 | C32.P$2 78.2,43.4 | C13.P$1 92.8,12.4 U3.P$2
  Bottom 1.5: U3.P$2 93.8,12.4
  Bottom 2: 78.7,44.5 78.2,44 78.2,43.4 78.2,37.8 78.2,26.9 78.2,26.5 78.2,25.3 78.2,24.7 v76,22.51 76,21.1 76,18.7 | 76,18.7 76.8,18.7 83,18.7 C6.+ 89.7,12.4 93.8,12.4 | CON2.P$2 74.31,17.91 75.1,18.7 76,18.7
AD0_CLK
  Top 0.2: IC2.27 109.45,87.15 109.4,87.2 109.4,93 115.5,99.1 130.18,99.1 CON57.6
AD0_DRDY
  Top 0.2: IC2.29 108.45,87.15 108.5,87.2 108.5,93.3 115.1,99.9 134.46,99.9 CON57.10
AD0_MISO